# EAGLE design YOTSUBA_MC_ver.2.4.1 (EAGLE 9.6.2)
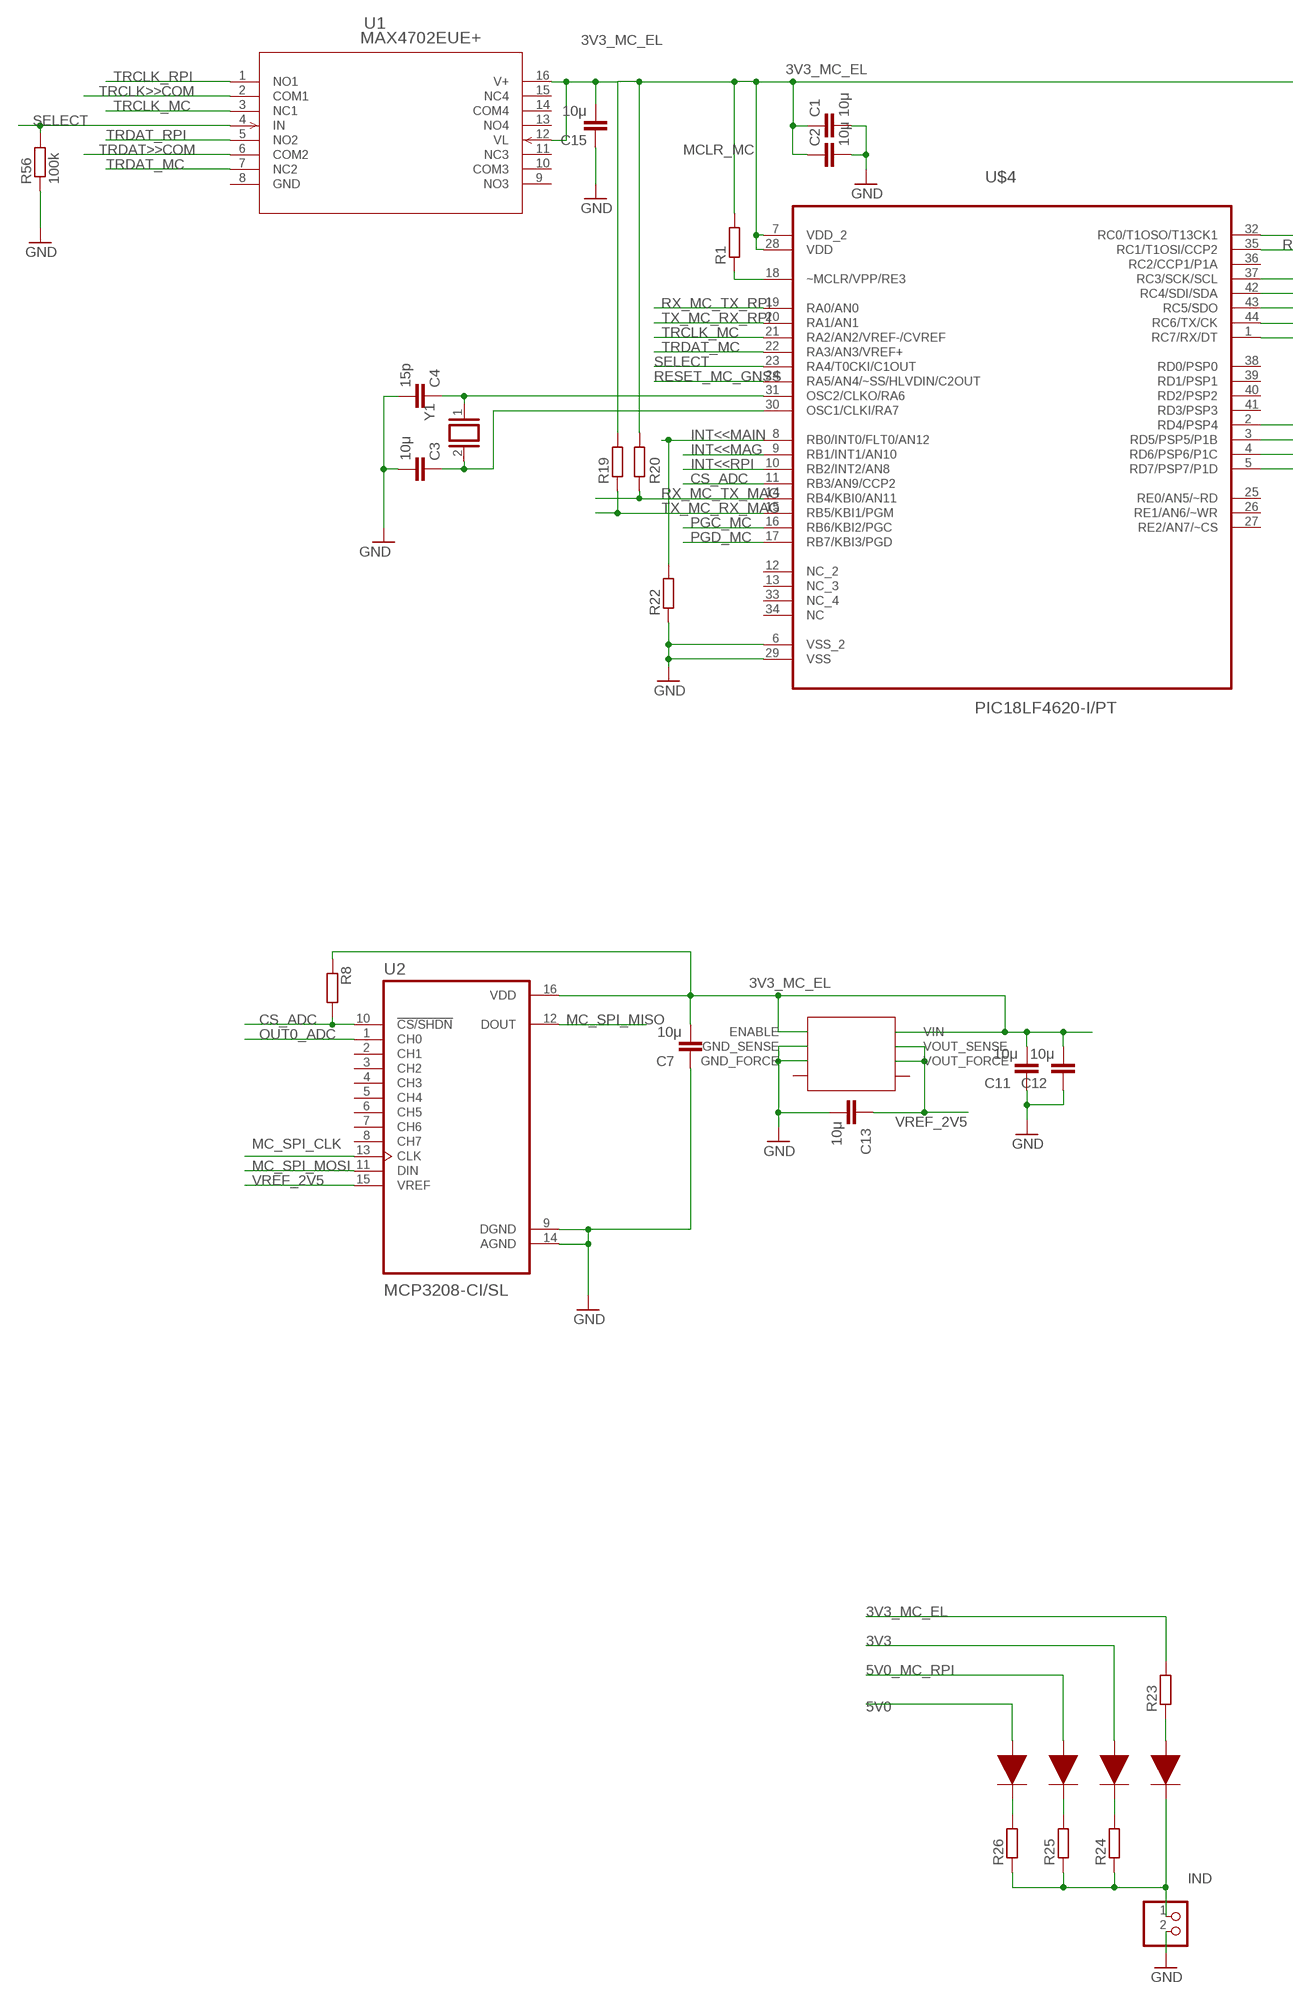
[diagram p0: schematic, sheet 1, part 1 of 2]
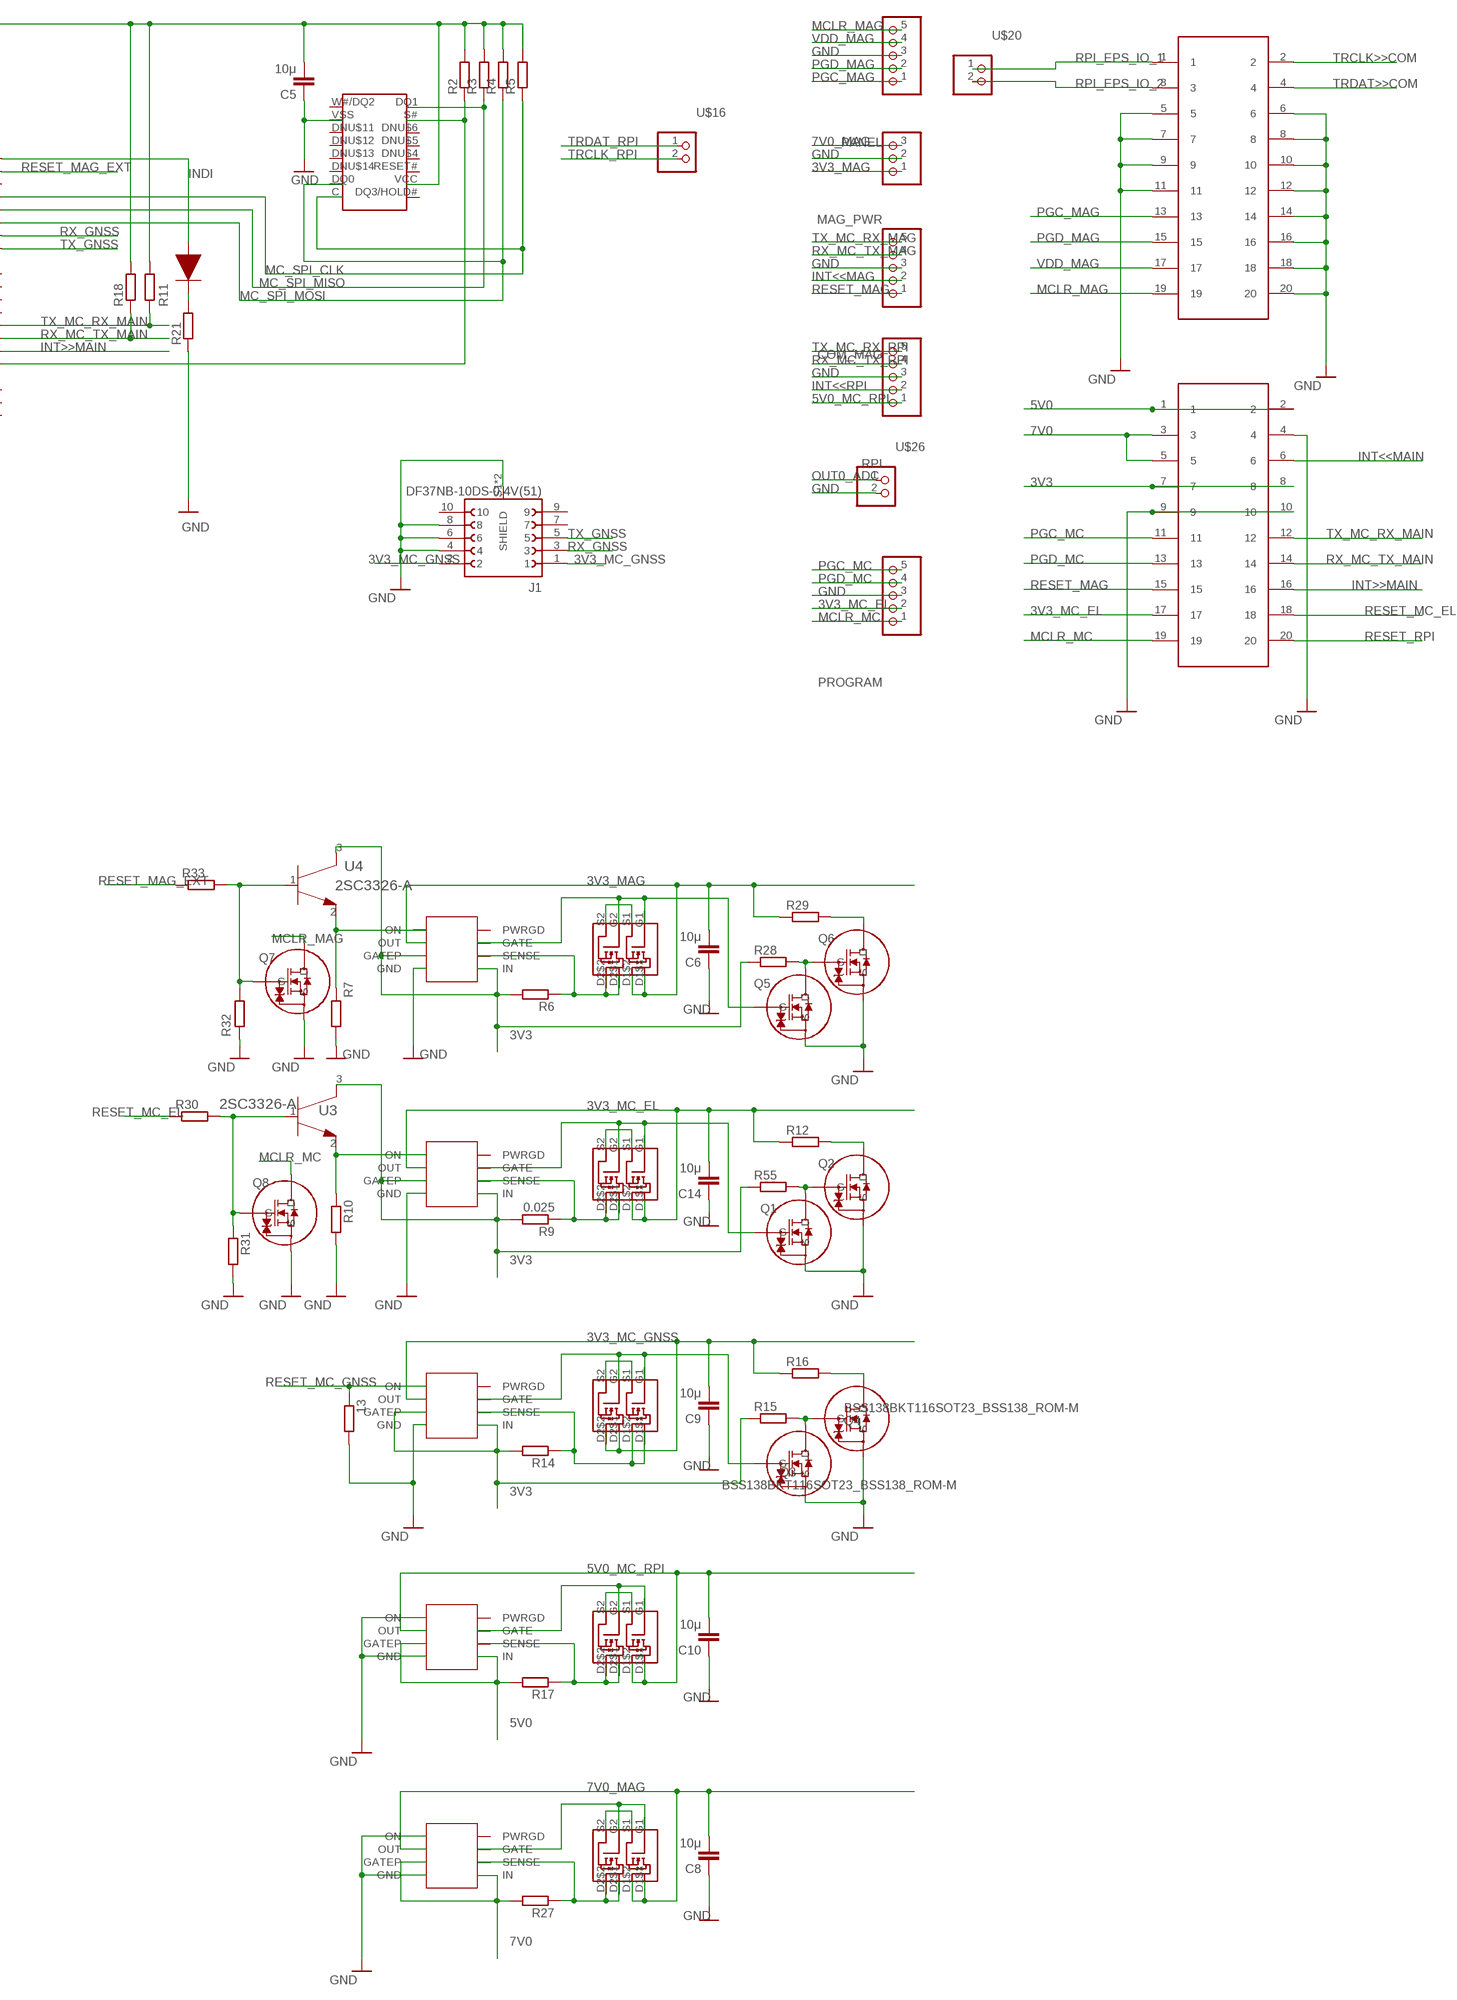
[diagram p1: schematic, sheet 1, part 2 of 2]

## Parts
13  R-EU_R2012  [R2012]
C1  10μ  C-EUC2012  [C2012]
C2  10μ  C-EUC2012  [C2012]
C3  10μ  C-EUC2012  [C2012]
C4  15p  C-EUC2012  [C2012]
C5  10μ  C-EUC2012  [C2012]
C6  10μ  C-EUC2012  [C2012]
C7  10μ  C-EUC2012  [C2012]
C8  10μ  C-EUC2012  [C2012]
C9  10μ  C-EUC2012  [C2012]
C10  10μ  C-EUC2012  [C2012]
C11  10μ  C-EUC2012  [C2012]
C12  10μ  C-EUC2012  [C2012]
C13  10μ  C-EUC2012  [C2012]
C14  10μ  C-EUC2012  [C2012]
C15  10μ  C-EUC2012  [C2012]
COM_MAG  PINHD-1X5  [1X05]
IND  PINHD-1X2  [1X02]
J1  DF37NB-10DS-0.4V(51)  [HRS_DF37NB-10DS-0.4V(51)]
MAG_PWR  PINHD-1X3  [1X03]
PANEL  PINHD-1X5  [1X05]
PROGRAM  PINHD-1X5  [1X05]
Q1  BSS138BKT116SOT23_BSS138_ROM-M  [SOT23_BSS138_ROM-M]
Q2  BSS138BKT116SOT23_BSS138_ROM-M  [SOT23_BSS138_ROM-M]
Q3  BSS138BKT116SOT23_BSS138_ROM-M  [SOT23_BSS138_ROM-M]
Q4  BSS138BKT116SOT23_BSS138_ROM-M  [SOT23_BSS138_ROM-M]
Q5  BSS138BKT116SOT23_BSS138_ROM-M  [SOT23_BSS138_ROM-M]
Q6  BSS138BKT116SOT23_BSS138_ROM-M  [SOT23_BSS138_ROM-M]
Q7  BSS138BKT116SOT23_BSS138_ROM-M  [SOT23_BSS138_ROM-M]
Q8  BSS138BKT116SOT23_BSS138_ROM-M  [SOT23_BSS138_ROM-M]
R1  R-EU_R2012  [R2012]
R2  R-EU_R2012  [R2012]
R3  R-EU_R2012  [R2012]
R4  R-EU_R2012  [R2012]
R5  R-EU_R2012  [R2012]
R6  R-EU_R2012  [R2012]
R7  R-EU_R2012  [R2012]
R8  R-EU_R2012  [R2012]
R9  0.025  R-EU_R2012  [R2012]
R10  R-EU_R2012  [R2012]
R11  R-EU_R2012  [R2012]
R12  R-EU_R2012  [R2012]
R14  R-EU_R2012  [R2012]
R15  R-EU_R2012  [R2012]
R16  R-EU_R2012  [R2012]
R17  R-EU_R2012  [R2012]
R18  R-EU_R2012  [R2012]
R19  R-EU_R2012  [R2012]
R20  R-EU_R2012  [R2012]
R21  R-EU_R2012  [R2012]
R22  R-EU_R2012  [R2012]
R23  R-EU_R2012  [R2012]
R24  R-EU_R2012  [R2012]
R25  R-EU_R2012  [R2012]
R26  R-EU_R2012  [R2012]
R27  R-EU_R2012  [R2012]
R28  R-EU_R2012  [R2012]
R29  R-EU_R2012  [R2012]
R30  R-EU_R2012  [R2012]
R31  R-EU_R2012  [R2012]
R32  R-EU_R2012  [R2012]
R33  R-EU_R2012  [R2012]
R55  R-EU_R2012  [R2012]
R56  100k  R-EU_R2012  [R2012]
RPI  PINHD-1X5  [1X05]
U1  MAX4702EUE+  [21-0066J_16]
U2  MCP3208-CI/SL  [SOIC127P600X175-16N]
U3  2SC3326-A  [S-MINI_TOS]
U4  2SC3326-A  [S-MINI_TOS]
U$1  MT25QL512_16SOP2  [SOIC127P1032X265-16N]
U$2  DMG6898LSD  [SOIC127P600X150-8N]
U$3  LTC4361  [SOP65P280X100-8N]
U$4  PIC18LF4620-I/PT  [QFP80P1200X1200X120-44N]
U$7  DMG6898LSD  [SOIC127P600X150-8N]
U$8  LTC4361  [SOP65P280X100-8N]
U$9  DMG6898LSD  [SOIC127P600X150-8N]
U$10  DMG6898LSD  [SOIC127P600X150-8N]
U$11  LTC4361  [SOP65P280X100-8N]
U$12  LTC4361  [SOP65P280X100-8N]
U$13  DMG6898LSD  [SOIC127P600X150-8N]
U$14  LTC4361  [SOP65P280X100-8N]
U$16  PINHD-1X2  [1X02]
U$17  M50-3001045  [M50-3001045]
U$18  LED_1608  [LED_1608]
U$19  ADR35XX  [SOP65P490X110-8N]
U$20  PINHD-1X2  [1X02]
U$21  LED_1608  [LED_1608]
U$22  M50-3001045  [M50-3001045]
U$23  LED_1608  [LED_1608]
U$24  LED_1608  [LED_1608]
U$25  LED_1608  [LED_1608]
U$26  PINHD-1X2  [1X02]
Y1  HC-49/U-S16000000ABJB  [XTAL_HC49P488W43L1150T466H350]

## Nets
3V3 [POWER]: R6.2 R9.2 R14.2 R15.1 R28.1 R55.1 U3.3(COLLECTOR) U4.3(COLLECTOR) U$3.GATEP U$3.IN U$8.GATEP U$8.IN U$11.GATEP U$11.IN U$17.7 U$17.8 U$23.A
3V3_MAG [POWER]: C6.2 MAG_PWR.1 R29.1 U$2.D1$1 U$2.D1$2 U$3.OUT
3V3_MC_EL [POWER]: C1.1 C2.1 C5.2 C7.2 C11.2 C12.2 C14.2 C15.2 PROGRAM.2 R1.2 R2.2 R3.2 R4.2 R5.2 R8.1 R11.2 R12.1 R18.2 R19.2 R20.2 R23.2 U1.12(VL) U1.16(V+) U2.16(VDD) U$1.VCC U$4.7(VDD_2) U$4.28(VDD) U$7.D1$1 U$7.D1$2 U$8.OUT U$17.17 U$19.ENABLE U$19.VIN
3V3_MC_GNSS [POWER]: C9.2 J1.1 J1.2 R16.1 U$10.D2$1 U$10.D2$2 U$11.OUT
5V0 [POWER]: R17.2 U$14.GATEP U$14.IN U$17.1 U$17.2 U$25.A
5V0_MC_RPI [POWER]: C10.2 RPI.1 U$13.D1$1 U$13.D1$2 U$14.OUT U$24.A
7V0 [POWER]: R27.2 U$12.GATEP U$12.IN U$17.3 U$17.5
7V0_MAG [POWER]: C8.2 MAG_PWR.3 U$9.D1$1 U$9.D1$2 U$12.OUT
CS_ADC: R8.2 U2.10(!CS/SHDN) U$4.11(RB3/AN9/CCP2)
GND [gnd]: 13.2 C1.2 C2.2 C3.2 C4.2 C5.1 C6.1 C7.1 C8.1 C9.1 C10.1 C11.1 C12.1 C13.2 C14.1 C15.1 COM_MAG.3 IND.2 J1.4 J1.6 J1.8 J1.S1(SHIELD) J1.S2(SHIELD) MAG_PWR.2 PANEL.3 PROGRAM.3 Q1.1(S) Q2.1(S) Q3.1(S) Q4.1(S) Q5.1(S) Q6.1(S) Q7.1(S) Q8.1(S) R7.2 R10.2 R21.1 R22.1 R31.2 R32.2 R56.1 RPI.3 U2.9(DGND) U2.14(AGND) U$1.VSS U$3.GND U$4.6(VSS_2) U$4.29(VSS) U$8.GND U$11.GND U$12.GND U$12.ON U$14.GND U$14.ON U$17.4 U$17.9 U$17.10 U$19.GND_FORCE U$19.GND_SENSE U$22.5 U$22.6 U$22.7 U$22.8 U$22.9 U$22.10 U$22.11 U$22.12 U$22.14 U$22.16 U$22.18 U$22.20 U$26.2
INDI: U$4.32(RC0/T1OSO/T13CK1) U$18.A
INT<<MAG: COM_MAG.2 U$4.9(RB1/INT1/AN10)
INT<<MAIN: R22.2 U$4.8(RB0/INT0/FLT0/AN12) U$17.6
INT<<RPI: RPI.2 U$4.10(RB2/INT2/AN8)
INT>>MAIN: U$4.4(RD6/PSP6/P1C) U$17.16
MC_SPI_CLK: R5.1 U2.13(CLK) U$1.C U$4.37(RC3/SCK/SCL)
MC_SPI_MISO: R3.1 U2.12(DOUT) U$1.DQ1 U$4.42(RC4/SDI/SDA)
MC_SPI_MOSI: R4.1 U2.11(DIN) U$1.DQ0 U$4.43(RC5/SDO)
MCLR_MAG: PANEL.5 Q7.3(D) U$22.19
MCLR_MC: PROGRAM.1 Q8.3(D) R1.1 U$4.18(~MCLR/VPP/RE3) U$17.19
N$1: R10.1 U3.2(EMITTER) U$8.ON
N$2: R23.1 U$21.A
N$3: C3.1 U$4.30(OSC1/CLKI/RA7) Y1.2
N$4: R24.2 U$23.C
N$5: C4.1 U$4.31(OSC2/CLKO/RA6) Y1.1
N$6: R25.2 U$24.C
N$7: R26.2 U$25.C
N$8: R2.1 U$1.S# U$4.5(RD7/PSP7/P1D)
N$9: IND.1 R24.1 R25.1 R26.1 U$21.C
N$10: U$2.S1 U$2.S2
N$11: R6.1 U$2.D2$1 U$2.D2$2 U$3.SENSE
N$12: Q5.2(G) U$2.G1 U$2.G2 U$3.GATE
N$13: Q5.3(D) Q6.2(G) R28.2
N$14: U$9.S1 U$9.S2
N$15: R21.2 U$18.C
N$16: R27.1 U$9.D2$1 U$9.D2$2 U$12.SENSE
N$17: U$9.G1 U$9.G2 U$12.GATE
N$18: Q6.3(D) R29.2
N$19: U$7.S1 U$7.S2
N$20: R9.1 U$7.D2$1 U$7.D2$2 U$8.SENSE
N$21: Q8.2(G) R30.2 R31.1 U3.1(BASE)
N$22: Q1.2(G) U$7.G1 U$7.G2 U$8.GATE
N$23: R7.1 U4.2(EMITTER) U$3.ON
N$24: Q1.3(D) Q2.2(G) R55.2
N$25: Q7.2(G) R32.1 R33.2 U4.1(BASE)
N$26: Q2.3(D) R12.2
N$28: U$10.S1 U$10.S2
N$29: R14.1 U$10.D1$1 U$10.D1$2 U$11.SENSE
N$30: Q3.2(G) U$10.G1 U$10.G2 U$11.GATE
N$33: Q3.3(D) Q4.2(G) R15.2
N$34: Q4.3(D) R16.2
N$36: U$13.S1 U$13.S2
N$37: R17.1 U$13.D2$1 U$13.D2$2 U$14.SENSE
N$38: U$13.G1 U$13.G2 U$14.GATE
OUT0_ADC: U2.1(CH0) U$26.1
PGC_MAG: PANEL.1 U$22.13
PGC_MC: PROGRAM.5 U$4.16(RB6/KBI2/PGC) U$17.11
PGD_MAG: PANEL.2 U$22.15
PGD_MC: PROGRAM.4 U$4.17(RB7/KBI3/PGD) U$17.13
RESET_MAG: COM_MAG.1 U$17.15
RESET_MAG_EXT: R33.1 U$4.35(RC1/T1OSI/CCP2)
RESET_MC_EL: R30.1 U$17.18
RESET_MC_GNSS: 13.1 U$4.24(RA5/AN4/~SS/HLVDIN/C2OUT) U$11.ON
RESET_RPI: U$17.20
RPI_EPS_IO_1: U$20.1 U$22.1
RPI_EPS_IO_2: U$20.2 U$22.3
RX_GNSS: J1.3 U$4.44(RC6/TX/CK)
RX_MC_TX_MAG: COM_MAG.4 R20.1 U$4.14(RB4/KBI0/AN11)
RX_MC_TX_MAIN: R18.1 U$4.3(RD5/PSP5/P1B) U$17.14
RX_MC_TX_RPI: RPI.4 U$4.19(RA0/AN0)
SELECT: R56.2 U1.4(IN) U$4.23(RA4/T0CKI/C1OUT)
TRCLK>>COM: U1.2(COM1) U$22.2
TRCLK_MC: U1.3(NC1) U$4.21(RA2/AN2/VREF-/CVREF)
TRCLK_RPI: U1.1(NO1) U$16.1
TRDAT>>COM: U1.6(COM2) U$22.4
TRDAT_MC: U1.7(NC2) U$4.22(RA3/AN3/VREF+)
TRDAT_RPI: U1.5(NO2) U$16.2
TX_GNSS: J1.5 U$4.1(RC7/RX/DT)
TX_MC_RX_MAG: COM_MAG.5 R19.1 U$4.15(RB5/KBI1/PGM)
TX_MC_RX_MAIN: R11.1 U$4.2(RD4/PSP4) U$17.12
TX_MC_RX_RPI: RPI.5 U$4.20(RA1/AN1)
VDD_MAG: PANEL.4 U$22.17
VREF_2V5: C13.1 U2.15(VREF) U$19.VOUT_FORCE U$19.VOUT_SENSE
Unconnected: J1.7 J1.9 J1.10 U1.9(NO3) U1.10(COM3) U1.11(NC3) U1.13(NO4) U1.14(COM4) U1.15(NC4) U2.2(CH1) U2.3(CH2) U2.4(CH3) U2.5(CH4) U2.6(CH5) U2.7(CH6) U2.8(CH7) U$1.DNU$4 U$1.DNU$5 U$1.DNU$6 U$1.DNU$11 U$1.DNU$12 U$1.DNU$13 U$1.DNU$14 U$1.DQ3/HOLD# U$1.RESET# U$1.W#/DQ2 U$3.PWRGD U$4.12(NC_2) U$4.13(NC_3) U$4.25(RE0/AN5/~RD) U$4.26(RE1/AN6/~WR) U$4.27(RE2/AN7/~CS) U$4.33(NC_4) U$4.34(NC) U$4.36(RC2/CCP1/P1A) U$4.38(RD0/PSP0) U$4.39(RD1/PSP1) U$4.40(RD2/PSP2) U$4.41(RD3/PSP3) U$8.PWRGD U$11.PWRGD U$12.PWRGD U$14.PWRGD U$19.NIC@1(NIC) U$19.NIC@2(NIC)

## Power pins joined to a net without a drawn wire
GND: U1.8(GND)

## Library data of the parts
13 R1-R12 R14-R33 R55 R56 = rcl:R-EU_: RESISTOR, European symbol; SPICEPREFIX: R
C1-C15 = rcl:C-EU: CAPACITOR, European symbol; SPICEPREFIX: C
COM_MAG PANEL PROGRAM RPI = pinhead:PINHD-1X5: PIN HEADER
IND U$16 U$20 U$26 = pinhead:PINHD-1X2: PIN HEADER
J1 = DF37NB-10DS-0.4V_51_:DF37NB-10DS-0.4V(51): Check availability <https://pricing.snapeda.com/parts/DF37NB-10DS-0.4V%2851%29/Hirose/view-part?ref=eda>; AVAILABILITY: In Stock; DESCRIPTION: 10 Position Connector Receptacle, Center Strip Contacts Surface Mount Gold; MF: Hirose; MP: DF37NB-10DS-0.4V(51); PACKAGE: None; PRICE: None; PURCHASE-URL: https://pricing.snapeda.com/search?q=DF37NB-10DS-0.4V(51)&ref=eda
MAG_PWR = pinhead:PINHD-1X3: PIN HEADER
Q1-Q8 = BSS138BKT:BSS138BKT116; COPYRIGHT: Copyright (C) 2023 Ultra Librarian. All rights reserved.; DIGIKEY_PART_NUMBER_1: 846-BSS138BKT116TR-ND; DIGIKEY_PART_NUMBER_2: 846-BSS138BKT116CT-ND; DIGIKEY_PART_NUMBER_3: 846-BSS138BKT116DKR-ND; MANUFACTURER_PART_NUMBER: BSS138BKT116; MFR_NAME: ROHM Semiconductor
U1 = MAX4702:MAX4702EUE+; COPYRIGHT: Copyright (C) 2022 Ultra Librarian. All rights reserved.; MANUFACTURER_PART_NUMBER: MAX4702EUE+; MFR_NAME: Analog Devices Inc
U2 = MCP3208-CI_SL:MCP3208-CI/SL: Check availability <https://pricing.snapeda.com/parts/MCP3208-CI/SL/Microchip%20Technology/view-part?ref=eda>; AVAILABILITY: In Stock; DESCRIPTION: 12 Bit Analog to Digital Converter 4, 8 Input 1 SAR 16-SOIC; MF: Microchip Technology; MP: MCP3208-CI/SL; PACKAGE: SOIC-16 Microchip; PRICE: None; PURCHASE-URL: https://pricing.snapeda.com/search?q=MCP3208-CI/SL&ref=eda
U3 U4 = 2sc3326:2SC3326-A; COPYRIGHT: Copyright (C) 2023 Ultra Librarian. All rights reserved.; DIGIKEY_PART_NUMBER_1: 2SC3326-ALFTR-ND; DIGIKEY_PART_NUMBER_2: 2SC3326-ALFCT-ND; DIGIKEY_PART_NUMBER_3: 2SC3326-ALFDKR-ND; MANUFACTURER_PART_NUMBER: 2SC3326-A; MFR_NAME: Toshiba Electronic Devices & Storage Corp.
U$1 = MT25QL512_8:MT25QL512_16SOP2
U$2 U$7 U$9 U$10 U$13 = DMG6898LSD:DMG6898LSD
U$3 U$8 U$11 U$12 U$14 = ltc4361:LTC4361
U$4 = PIC18LF4620-I_PT:PIC18LF4620-I/PT: Flash Microcontrollers Check availability <https://pricing.snapeda.com/parts/PIC18LF4620-I/PT/Microchip/view-part?ref=eda>; AVAILABILITY: In Stock; DESCRIPTION: PIC PIC® 18F Microcontroller IC 8-Bit 40MHz 64KB (32K x 16) FLASH 44-TQFP (10x10); MF: Microchip; MP: PIC18LF4620-I/PT; PACKAGE: TQFP-44 Microchip; PRICE: None; PURCHASE-URL: https://pricing.snapeda.com/search?q=PIC18LF4620-I/PT&ref=eda
U$17 U$22 = MITSUBA_Connectors-v4.0:M50-3001045: 20pins 1.27mm pitch 2line pinsocket
U$18 U$21 U$23-U$25 = LED_1608:LED_1608
U$19 = adr35xx:ADR35XX
Y1 = HC-49_U-S16000000ABJB:HC-49/U-S16000000ABJB: HC49US Series 16 MHz ±30 ppm 18 pF -20 to +70 °C Through Hole AT-CUT Crystal; DESCRIPTION: 16 MHz ±30ppm Crystal 18pF 50 Ohms HC-49/US; DIGI-KEY_PART_NUMBER: 300-6034-ND; MF: Citizen Finedevice Co Ltd; MP: HC-49/U-S16000000ABJB; PACKAGE: HC-49/US Citizen Finetech Miyota; PURCHASE-URL: https://pricing.snapeda.com/search?q=HC-49/U-S16000000ABJB&ref=eda

## Net classes
0 default: clearance 0.178 mm
1 ant: clearance 0.559 mm
2 gnd: clearance 0.381 mm
3 POWER: width 0.178 mm, clearance 0.254 mm

## Board
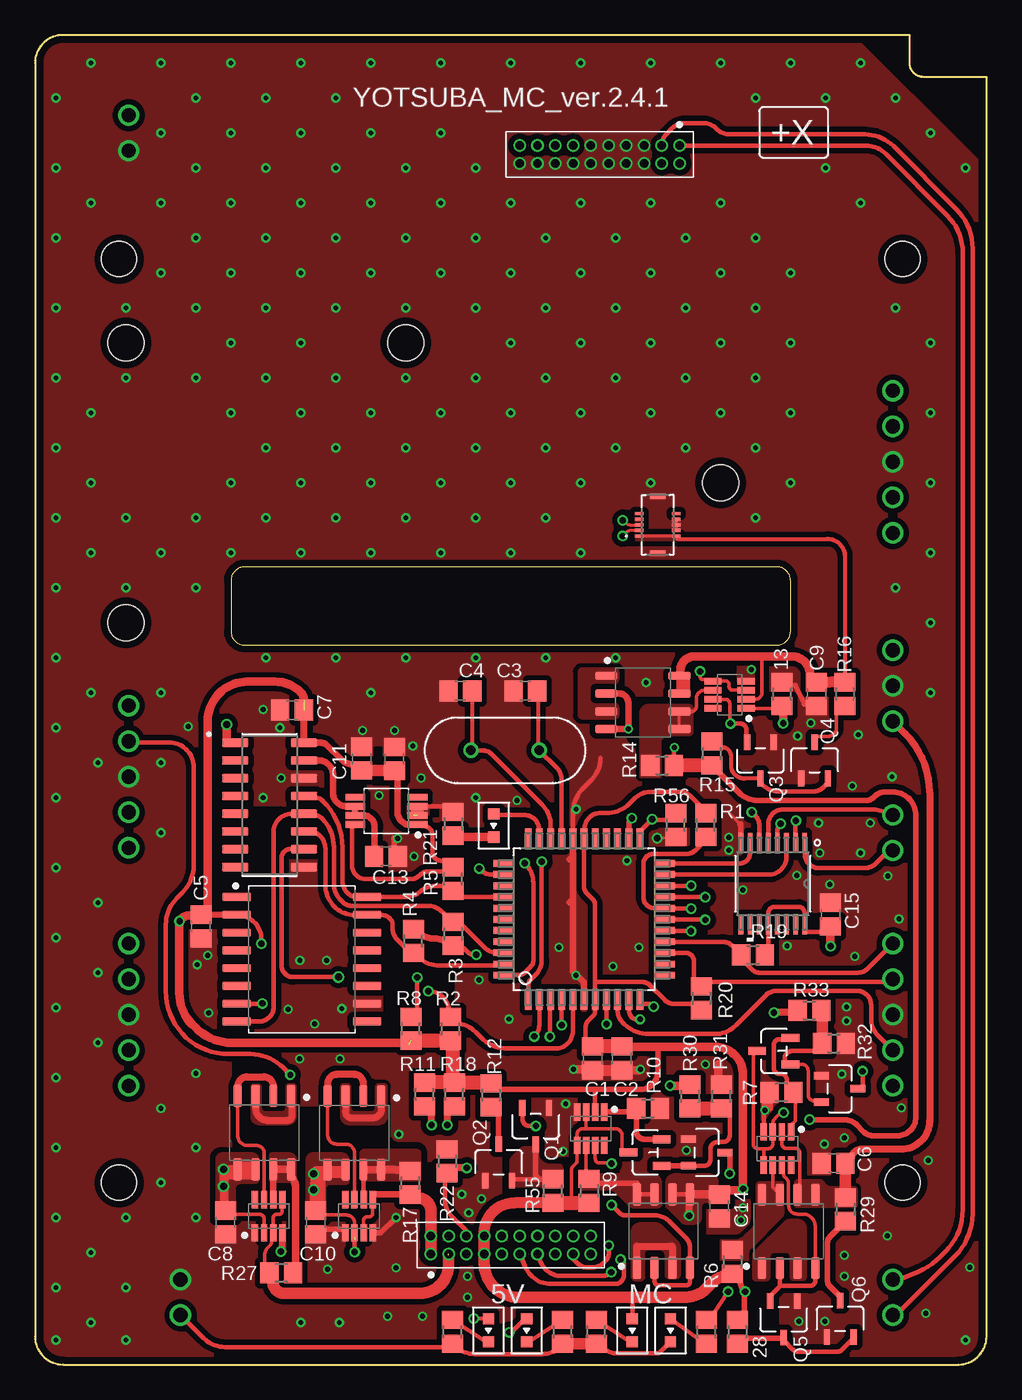
[diagram p2: board, top side]
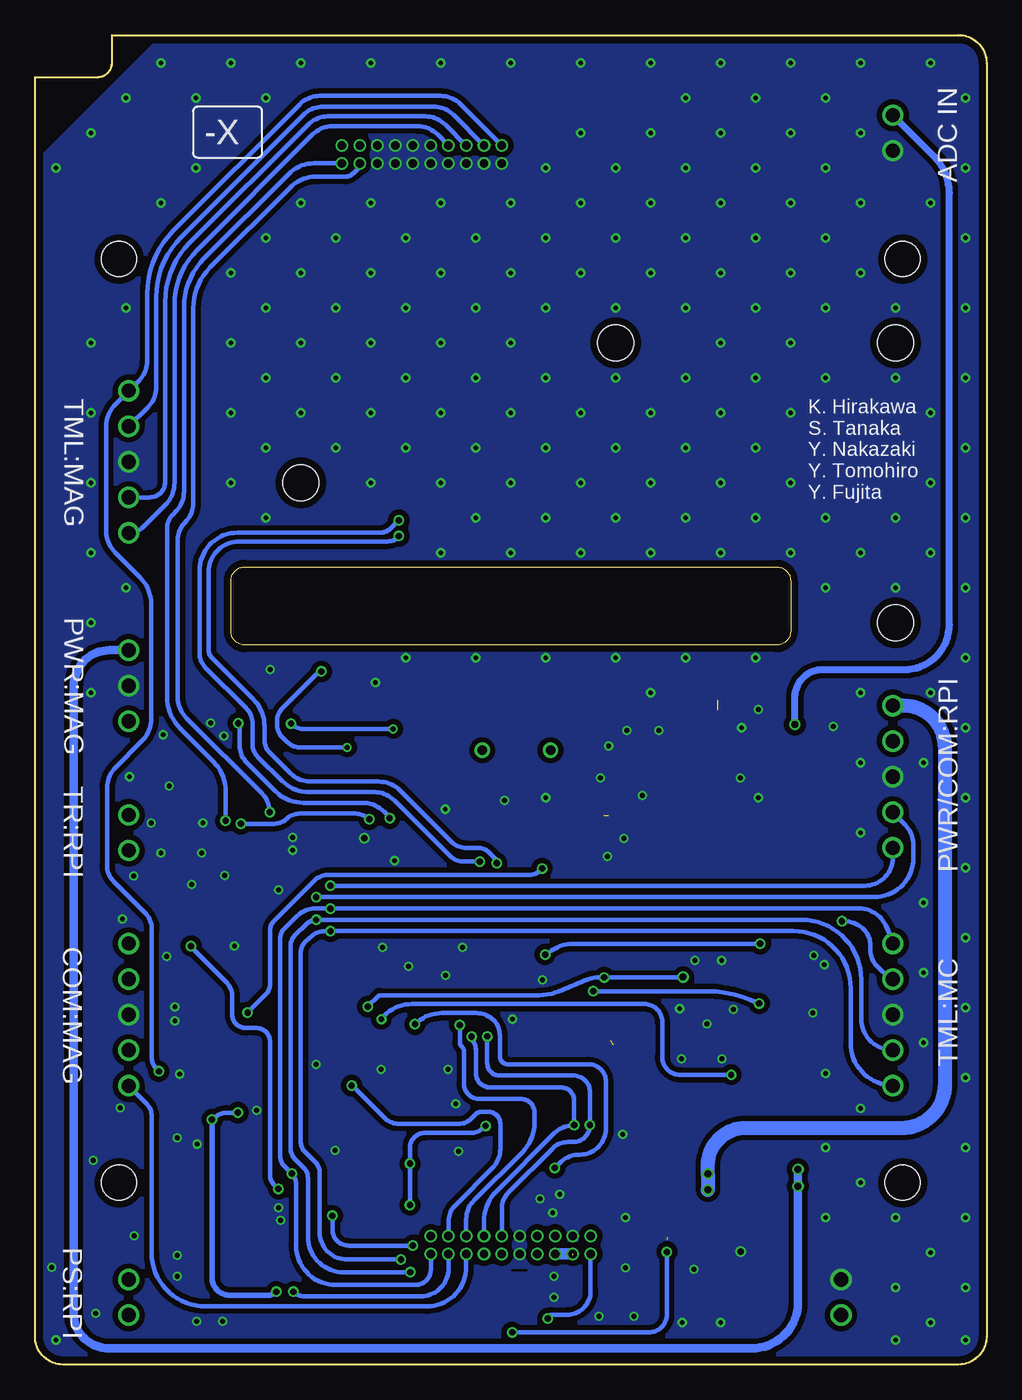
[diagram p3: board, bottom side, seen from below]

Size 68 x 95 mm. Coordinates in mm from the lower left corner, seen from the top.
Outline: 0,93 0,2 arc90 2,0 66,0 arc90 68,2 68,92 63.5,92 arc-90 62.5,93 62.5,95 2,95 arc90 0,93
Outline: 14,56 14,52.4 arc90 15,51.4 53,51.4 arc90 54,52.4 54,56 arc90 53,57 15,57 arc90 14,56
Copper layers (1*16): Top 0.035mm / dielectric 1.53mm / Bottom 0.035mm
Design rules "pban_5mil-l2": minimum track width 5mil, minimum drill 0.3mm, track to track 5mil, track to pad 0.229mm, pad to pad 5mil, via to via 5mil, smd to smd 5mil, copper to edge 0.5mm, drill to drill 0.5mm, minimum pad ring 0.15mm, minimum via ring 0.15mm, stop-mask expansion 4mil, vias tented up to drill 0.35mm, thermal gap 10mil
Holes 2.5 mm at 6,13 62,13 62,79 6,79
Holes 2.6 mm at 6.5,73 6.5,53 49,63 26.5,73
tRestrict: area 24.3,43.8 to 24.7,44.1; area 15,33.9 to 16.7,34.2; area 28.2,39.1 to 28.9,39.7; 48 lines
bRestrict: area 32.9,6.8 to 33.9,6.8; area 6.4,24.7 to 6.9,25

### Footprints (pad centres in the part's own frame; a part is rotated, then mirrored left to right if it is on the bottom)
R2012 = smd 1.3 x 1.5: 1 -0.85,0; 2 0.85,0
C2012 = smd 1.3 x 1.5: 1 -0.85,0; 2 0.85,0
1X05 = drill 1.016: 1 -5.08,0; 2 -2.54,0; 3 0,0; 4 2.54,0; 5 5.08,0
1X02 = drill 1.016: 1 -1.27,0; 2 1.27,0
HRS_DF37NB-10DS-0.4V(51) = smd 0.23 x 0.63: 1 0.8,-1.325; 2 0.8,1.325; 3 0.4,-1.325; 4 0.4,1.325; 5 0,-1.325; 6 0,1.325; 7 -0.4,-1.325; 8 -0.4,1.325; 9 -0.8,-1.325; 10 -0.8,1.325 | smd 0.38 x 1.1: S1 2.04,0; S2 -2.04,0
1X03 = drill 1.016: 1 -2.54,0; 2 0,0; 3 2.54,0
SOT23_BSS138_ROM-M = smd 1.105 x 0.508: 1 -1.302,0.95; 2 -1.302,-0.95; 3 1.302,0
21-0066J_16 = smd 1.379 x 0.34: 1 -2.937,2.275; 2 -2.937,1.625; 3 -2.937,0.975; 5 -2.937,-0.325; 6 -2.937,-0.975; 7 -2.937,-1.625; 8 -2.937,-2.275; 9 2.937,-2.275; 10 2.937,-1.625; 11 2.937,-0.975; 12 2.937,-0.325; 13 2.937,0.325; 14 2.937,0.975; 15 2.937,1.625; 16 2.937,2.275 | smd 1.379 x 0.3: 4 -2.937,0.325
SOIC127P600X175-16N = smd 1.9 x 0.6: 1 -2.455,4.445; 2 -2.455,3.175; 3 -2.455,1.905; 4 -2.455,0.635; 5 -2.455,-0.635; 6 -2.455,-1.905; 7 -2.455,-3.175; 8 -2.455,-4.445; 9 2.455,-4.445; 10 2.455,-3.175; 11 2.455,-1.905; 12 2.455,-0.635; 13 2.455,0.635; 14 2.455,1.905; 15 2.455,3.175; 16 2.455,4.445
S-MINI_TOS = smd 0.56 x 1.325: 1 -0.95,-1.187; 2 0.95,-1.187; 3 0,1.187
SOIC127P1032X265-16N = smd 2.052 x 0.602: C 4.654,4.445; DNU$4 -4.654,0.635; DNU$5 -4.654,-0.635; DNU$6 -4.654,-1.905; DNU$11 4.654,-1.905; DNU$12 4.654,-0.635; DNU$13 4.654,0.635; DNU$14 4.654,1.905; DQ0 4.654,3.175; DQ1 -4.654,-4.445; DQ3/HOLD# -4.654,4.445; RESET# -4.654,1.905; S# -4.654,-3.175; VCC -4.654,3.175; VSS 4.654,-3.175; W#/DQ2 4.654,-4.445
SOIC127P600X150-8N = smd 1.58 x 0.589: D1$1 -2.625,1.905; D1$2 -2.625,0.635; D2$1 -2.625,-0.635; D2$2 -2.625,-1.905; G1 2.625,1.905; G2 2.625,-0.635; S1 2.625,0.635; S2 2.625,-1.905
SOP65P280X100-8N = smd 1.237 x 0.459: GATE 1.187,0.325; GATEP -1.187,-0.325; GND -1.187,-0.975; IN 1.187,-0.975; ON -1.187,0.975; OUT -1.187,0.325; PWRGD 1.187,0.975; SENSE 1.187,-0.325
QFP80P1200X1200X120-44N = smd 1.473 x 0.483: 1 -5.74,3.988; 2 -5.74,3.2; 3 -5.74,2.388; 4 -5.74,1.6; 5 -5.74,0.787; 6 -5.74,0; 7 -5.74,-0.787; 8 -5.74,-1.6; 9 -5.74,-2.388; 10 -5.74,-3.2; 11 -5.74,-3.988; 23 5.74,-3.988; 24 5.74,-3.2; 25 5.74,-2.388; 26 5.74,-1.6; 27 5.74,-0.787; 28 5.74,0; 29 5.74,0.787; 30 5.74,1.6; 31 5.74,2.388; 32 5.74,3.2; 33 5.74,3.988 | smd 0.483 x 1.473: 12 -3.988,-5.74; 13 -3.2,-5.74; 14 -2.388,-5.74; 15 -1.6,-5.74; 16 -0.787,-5.74; 17 0,-5.74; 18 0.787,-5.74; 19 1.6,-5.74; 20 2.388,-5.74; 21 3.2,-5.74; 22 3.988,-5.74; 34 3.988,5.74; 35 3.2,5.74; 36 2.388,5.74; 37 1.6,5.74; 38 0.787,5.74; 39 0,5.74; 40 -0.787,5.74; 41 -1.6,5.74; 42 -2.388,5.74; 43 -3.2,5.74; 44 -3.988,5.74
M50-3001045 = drill 0.6: 1 0,0; 2 0,1.27; 3 1.27,0; 4 1.27,1.27; 5 2.54,0; 6 2.54,1.27; 7 3.81,0; 8 3.81,1.27; 9 5.08,0; 10 5.08,1.27; 11 6.35,0; 12 6.35,1.27; 13 7.62,0; 14 7.62,1.27; 15 8.89,0; 16 8.89,1.27; 17 10.16,0; 18 10.16,1.27; 19 11.43,0; 20 11.43,1.27
LED_1608 = smd 0.8 x 0.8: A 0.4,0.4; C 2.05,0.4
SOP65P490X110-8N = smd 1.424 x 0.497: ENABLE -2.219,0.975; GND_FORCE -2.219,-0.325; GND_SENSE -2.219,0.325; NIC@1 -2.219,-0.975; NIC@2 2.219,-0.975; VIN 2.219,0.975; VOUT_FORCE 2.219,-0.325; VOUT_SENSE 2.219,0.325
XTAL_HC49P488W43L1150T466H350 = drill 0.68 pad 1.08: 1 -2.44,0; 2 2.44,0

### Placement (x,y rotation side)
13  53.39,47.9 90 top
C1  39.85,21.88 270 top
C2  41.94,21.88 270 top
C3  35.05,48.14 180 top
C4  30.39,48.14 180 top
C5  11.87,31.29 90 top
C6  57.06,14.39 0 top
C7  18.37,46.76 0 top
C8  13.61,10.15 90 top
C9  55.85,47.9 90 top
C10  20.07,10.15 90 top
C11  23.35,43.29 270 top
C12  25.69,43.28 270 top
C13  25.08,36.32 0 top
C14  48.9,11.3 90 top
C15  56.85,32.15 270 top
COM_MAG  61.3,25 90 top
IND  10.4,4.8 90 top
J1  44.5,60 270 top
MAG_PWR  61.3,48.5 90 top
PANEL  61.3,64.5 90 top
PROGRAM  6.7,25 270 top
Q1  35.78,17.04 270 top
Q2  33.14,14.45 90 top
Q3  51.84,43.17 270 top
Q4  55.71,43.17 90 top
Q5  53.5,3.23 270 top
Q6  57.54,3.27 90 top
Q7  57.5,19.7 0 top
Q8  48,15.15 0 top
R1  47.93,38.55 90 top
R2  29.68,23.99 270 top
R3  29.87,30.78 270 top
R4  27.04,30.26 90 top
R5  29.88,34.69 90 top
R6  49.84,7.34 270 top
R7  53.34,19.45 180 top
R8  26.86,24 90 top
R9  39.6,12.41 270 top
R10  43.82,18.3 0 top
R11  27.84,19.3 90 top
R12  32.59,19.25 270 top
R14  44.82,42.81 0 top
R15  48.37,43.66 90 top
R16  57.88,47.9 270 top
R17  26.81,12.99 270 top
R18  29.97,19.3 90 top
R19  51.32,29.27 0 top
R20  47.62,26.17 270 top
R21  29.89,38.63 270 top
R22  29.46,14.53 270 top
R23  47.99,2.34 90 top
R24  40.11,2.34 90 top
R25  37.71,2.34 90 top
R26  29.83,2.34 90 top
R27  17.6,6.54 180 top
R28  50.19,2.34 270 top
R29  57.92,11.1 270 top
R30  46.8,19.15 270 top
R31  49.05,19.15 90 top
R32  57.1,22.95 0 top
R33  55.35,25.3 0 top
R55  37.02,12.4 90 top
R56  45.79,38.54 90 top
RPI  6.7,42 270 top
U1  52.73,34.36 270 top
U2  16.77,39.99 0 top
U3  43.6,15.15 90 top
U4  52.8,22.4 90 top
U$1  19.07,28.96 0 top
U$2  53.86,9.52 270 top
U$3  53.05,15.44 270 top
U$4  39.24,31.81 90 top
U$7  44.91,9.54 270 top
U$8  39.71,16.85 270 top
U$9  16.4,16.58 90 top
U$10  43.44,47.31 180 top
U$11  49.63,47.86 180 top
U$12  16.7,10.6 90 top
U$13  22.83,16.55 90 top
U$14  23.16,10.6 90 top
U$16  61.3,38 90 top
U$17  28.29,7.9 0 top
U$18  32.38,39.73 270 top
U$19  25.11,39.56 180 top
U$20  61.3,4.8 270 top
U$21  45.02,3.66 270 top
U$22  46.07,87.1 180 top
U$23  42.28,3.66 270 top
U$24  34.74,3.66 270 top
U$25  32,3.66 270 top
U$26  6.7,88 270 top
Y1  33.59,43.89 0 top

### Tracks (layer width: path | path; a pad name or v marks a point on that pad's centre or on a via)
3V3  (via drill 0.35, 0.45)
  Top 0.25: U$11.GATEP 49.87,48.19 arc-90 49.6,48.45 49.6,48.58 arc90 49.33,48.85 48.43,48.85 | 38.35,11.7 38.35,13.92 arc-45 38.44,14.14 38.64,14.34 arc45 38.73,14.57 U$8.IN 38.73,16.43 arc-90 39.15,16.85 39.38,16.85 | 39.38,16.85 41.48,16.85 arc-90 41.95,16.38 41.95,15.35 42.15,15.15 U3.3 | U$11.IN 48.34,48.94 47.75,48.94 arc-90 47.53,49.15 v47.53,49.52 | U$3.IN 52.08,15.43 52.41,15.43 arc90 52.73,15.74 U$3.GATEP 52.73,17.16 arc-45 52.91,17.61 53.16,17.86 arc-45 v53.5,18 | U$8.GATEP 39.38,16.85
  Top 0.254: U4.3 51.4,22.4 51.33,22.33 51.33,15.74 arc90 51.65,15.43 52.08,15.43
  Top 0.305: U$23.A 42.68,4.8 | U$11.IN 48.43,48.85 48.39,48.85 | 38.35,11.7 38.5,11.55 | R14.2 45.67,44.07 v45.7,44.1
  Top 0.4: R15.1 50.33,40.85 arc45 51.66,40.3 59.37,40.3 arc45 59.93,40.53 60.02,40.62 arc-45 60.7,40.9 61.3,40.9 arc-90 62.95,39.25 62.95,17.67 arc-90 61.63,16.35 59.9,16.35 arc-45 59.21,16.64 58.74,17.11 arc45 57.8,17.5 v55.35,17.5 55.35,17.4 | v50.75,5.2 50.75,5.15
  Top 0.406: R6.2 50.27,6.21 50.62,5.21 v50.75,5.2 50.7,5.1 50.7,3.19 R28.1
  Top 0.8: U$17.8 32.1,9.4 arc-90 34.25,11.55 R55.1 | R9.2
  Top 0.813: U$17.8 U$17.7 32.1,7.25 arc90 34.55,4.8 42.68,4.8 46.4,4.8 arc45 48.02,5.47 48.43,5.88 arc-45 49.55,6.34 49.69,6.34 R6.2
  Top 1: 45.77,42.71 R14.2 R15.1
  Top 1.016: R55.1 38.5,11.55 R9.2
  Bottom 0.305: U$17.8 32.1,9.31 | 47.45,49.5 47.51,49.5 v47.53,49.52 47.68,49.52 50.33,46.87 arc-45 50.7,45.97 50.7,45.73 arc-45 50.33,44.83 49.97,44.47 arc-45 49.07,44.1 v45.7,44.1 | v53.5,18 54.3,18 arc-45 55.16,17.64 55.3,17.5 arc-90 v55.35,17.5
  Bottom 0.4: v55.35,17.5 55.35,6.22 arc-90 54.08,4.95 51.35,4.95 arc-45 v50.75,5.2
3V3_MAG
  Top 0.203: 54.65,12.14 U$2.D1$2
  Top 0.25: U$3.OUT 53.38,15.77 arc90 53.69,15.45 54.33,15.45 arc-90 54.65,15.13 54.65,12.14
  Top 0.5: MAG_PWR.1 62.2,45.06 arc-45 63.93,40.88 63.93,17.41 arc-90 61.9,15.38 59.05,15.38 arc90 58.32,14.64 58.32,14.19 57.92,14.19
  Top 0.813: R29.1 57.92,14.19 C6.2
  pour Top (no thermals): 56.07,13.25 54.57,13.25 arc90 54.25,12.93 54.25,11.42 arc90 54.47,11.2 58.58,11.2 arc90 58.8,11.42 58.8,12.43 arc90 58.48,12.75 56.83,12.75 arc-45 56.61,12.84 56.29,13.16 arc45
3V3_MC_EL  (via drill 0.45)  (2 unrouted)
  Top 0.305: 27.32,31.21 R4.2 27.32,31.49 27.58,31.49 | 29.65,29.91 29.79,29.91 R3.2 29.94,29.76 30.62,29.76 30.91,29.48 arc45 31.36,29.29 v31.54,29.29 | U$17.17 38.45,7.56 38.81,7.2 arc45 39.47,6.93 39.77,6.93 arc45 40.68,7.31 40.81,7.44 arc45 41,7.89 v41,8.5 | 14.31,32.13 U$1.VCC arc-90 16.18,30.37 v16.18,30.07 | 27.6,38.59 U$19.ENABLE 27.43,38.48 27.77,38.48 arc-90 28.4,37.85 28.4,36.63 arc90 29.04,36 29.88,36 R5.2 29.8,35.58 29.47,35.24 28.11,35.24 arc45 27.56,35.01 27.52,34.97 arc-45 26.82,34.68 23.65,34.68 arc-90 22.65,35.68 22.65,38.34 U$19.VIN 23.32,38.59 | 26.45,23.11 26.22,22.88 | R1.2 47.93,39.52 46.84,40.61 arc45 46.11,40.91 43.93,40.91 arc45 42.87,40.47 42.46,40.06 arc-45 40.87,39.4 40.38,39.4 arc45 39.62,39.09 arc45 39.26,38.21 39.26,37.57 U$4.28 39.24,34.13 arc45 39.43,33.68 39.84,33.27 arc-45 40.03,32.82 40.03,27.35 | 49.56,5.23 v49.53,5.2 48.39,3.44 R23.2 | C1.1 39.33,23.25 39.33,24 arc-45 39.59,24.63 39.93,24.98 arc45 40.03,25.2 U$4.7 40.03,27.35 | 40.02,19.65 40.02,18.05 U$8.OUT | U$7.D1$2 U$7.D1$1 | 48.9,12.16 C14.2 | v46.75,10.63 v46.74,10.64 | R19.2 52.41,29.5 U1.12 52.41,32.27 arc-90 52.84,32.7 54.57,32.7 arc-90 55.01,32.27 U1.16 55.01,30.92 56.47,30.92 C15.2 | R20.2 47.17,25.77 45.66,25.77 arc-45 45.01,26.04 43.96,27.09 arc45 43.34,27.35 40.03,27.35
  Top 0.4: R12.1 33.04,19.65 40.02,19.65 43.23,19.65 arc90 44.5,20.92 44.5,22.69 43.85,22.69
  Top 0.45: 45.55,12.49 U$7.D1$2 | U$19.ENABLE 26.9,38.59 arc90 26.86,38.54 arc-90 25.91,39.49 25.91,42.21 arc90 C12.2 arc90 C12.2 | C11.2 22.94,42.85 22.83,42.85 arc-45 21.89,43.24 20.89,44.24 arc45 20.44,44.43 U2.16 | R5.2 arc-45 30,35.64 | 29.79,29.91 arc45 28.49,30.45 28.41,30.45 arc-45 27.37,30.88 R4.2 27.27,31.44 | C5.2 14.29,32.15 14.31,32.13 | C7.2
  Top 0.508: R4.2 27.09,31.16 | U2.16 C7.2 | v46.75,10.63 46.75,12.1 U$7.D1$1
  Top 0.6: R2.2 | 29.83,20.15 R11.2 | U$7.D1$1 48.9,12.16 | C14.2 arc90 49.2,12.45 50.5,12.45 v50.6,12.55 50.6,20.72 arc90 48.63,22.69 43.85,22.69 41.94,22.69 C2.1
  Top 0.61: 11.84,32.11 11.43,32.1 | 11.86,32.15 arc-90 C5.2 | 19.22,47.49 arc45 19,48.03 arc45 17.16,48.79 15.14,48.79 arc45 13.18,47.98 arc45 12.34,45.95 12.34,32.61 C5.2 | 26.58,22.98 14.11,22.98 arc-45 11.46,24.07 11.25,24.29 arc-45 10.31,26.54 10.31,31.66 v10.33,31.68 10.33,31.71 10.42,31.8 arc-45 11.15,32.11 11.84,32.11 | 26.45,23.11 26.58,22.98 | 26.58,22.98 arc-90 26.68,22.88 | 11.84,32.11 C5.2 | v56.85,29.9 C15.2 | R2.2 arc-23 29.69,23.05 29.67,23.05 arc-90 R2.2
  Top 0.8: R2.2 29.83,22.99 | 32.59,20.15 R12.1
  Top 0.813: C11.2 C12.2
  Top 1: R8.1 R2.2 | 29.83,22.99 29.83,20.15
  Top 1.016: R11.2 R18.2 32.59,20.15 | C2.1 C1.1
  Bottom 0.305: v16.18,30.07 16.38,30.07 16.39,30.06 29.57,30.06 arc-45 31.42,29.29 v31.54,29.29 | 10.19,31.68 arc45 8.76,31.09 arc45 8.3,29.97 8.3,29.57 arc-45 7.86,28.51 6.89,27.54 | U$17.17 38.45,6.86 arc90 40.43,4.88 48.79,4.88 arc45 49.5,5.17 v49.53,5.2 | 50.6,12.6 v50.6,12.55 50.98,12.93 arc45 51.2,13.46 51.2,23.05 arc-90 52.2,24.05 52.95,24.05 arc90 53.9,25 53.9,26.24 arc-45 54.36,27.36 56.85,29.85 v56.85,29.9 | v46.75,10.63 46.75,9.65 arc-90 45.6,8.5 v41,8.5
  Bottom 0.406: 6.89,27.54 PROGRAM.2
  Bottom 0.45: v10.33,31.68 10.19,31.68
  pour Top (no thermals): 47.15,10 46.51,10 arc-45 46.15,10.15 45.14,11.16 arc-45 45.05,11.38 45.05,13.02 arc-90 45.69,13.65 48.22,13.65 arc-90 48.85,13.02 48.85,11.55 47.97,11.55 arc90 47.65,11.23 47.65,10.5 arc-90
3V3_MC_GNSS
  Top 0.2: J1.2 45.95,59
  Top 0.225: J1.2 J1.1
  Top 0.254: U$11.OUT 51.48,47.53 arc90 51.95,48 51.95,50.6
  Top 0.3: 45.95,59 56.61,59 arc-90 57.88,57.73 R16.1 | U$10.D2$2 46.56,49.22
  Top 0.5: 46.12,49.27 arc90 U$10.D2$2 U$10.D2$1 | 46.56,49.22 46.56,47.95
  Top 0.6: 46.12,49.27 46.12,49.6 arc-90 47.12,50.6 51.95,50.6 54.06,50.6 arc-90 55.4,49.27 55.4,49.15 55.8,48.75 C9.2
  Top 0.813: C9.2 57.88,48.8 R16.1
  pour Top (no thermals): 46.05,58.85 42.9,58.85 42.9,59.3 46.05,59.3
5V0  (via drill 0.45)
  Top 0.25: U$14.IN 24.14,10.81 arc-90 23.88,10.56 23.74,10.56 arc90 23.48,10.31 U$14.GATEP
  Top 0.3: v31.35,3.29 32.4,3.29 U$25.A
  Top 0.305: U$14.IN 24.13,11.77 | 24.13,12.05 24.16,12.05
  Top 0.406: 24.13,11.76 24.13,11.77 24.13,12.05 | U$25.A 32.56,3.42
  Top 0.45: 24.14,11.33 U$14.IN 24.14,12.14 24.14,12.15 R17.2 26.74,11.97
  Top 0.813: U$17.1 U$17.2 28.29,10.99 arc90 27.38,11.9 26.98,11.9 R17.2
  Bottom 0.305: v31.35,3.29 arc90 31.08,3.56 29.97,3.56 arc-90 28.29,5.24 U$17.1
5V0_MC_RPI  (via drill 0.45, 0.5)  (1 unrouted)
  Top 0.25: U$14.OUT 22.84,10.13 arc90 22.28,10.68 20.61,10.68
  Top 0.305: U$14.OUT 22.84,9.09 | 22.84,8.9 22.84,8.2 22.82,8.18 22.82,8.07 v22.84,8.05 | v33.9,2.3 33.9,2.15 34.8,3.05 34.92,3.05 U$24.A
  Top 0.45: 20.61,10.68 19.86,11.42
  Top 0.5: v19.91,12.47 19.86,12.42 19.86,11.42 | 20.34,11.1 20.34,11.13 20.16,11.13 C10.2 20.07,13.93 U$13.D1$1 20.64,13.63 v19.91,13.63 19.89,13.62 19.89,12.91 | 20.5,13.6 20.5,11.51
  Top 0.55: U$13.D1$1 U$13.D1$2 | 20.75,13.59 22,13.59
  Bottom 0.305: v33.9,2.3 24.11,2.3 arc-90 22.84,3.57 v22.84,8.05
  Bottom 1: RPI.1 5.96,47.08 arc90 2.96,44.08 2.96,20.01 arc90 6.06,16.91 17.21,16.91 arc-90 19.91,14.21 v19.91,13.63 v19.91,12.47
  pour Top (no thermals): 19.35,11.15 19.35,14.65 arc-90 19.85,15.15 21.95,15.15 arc-90 22.45,14.65 22.45,13.07 arc-90 22.23,12.85 21.12,12.85 arc90 20.8,12.53 20.8,11.15
7V0  (1 unrouted)
  Top 0.25: U$12.IN 17.68,10.98 arc-90 17.42,10.73 17.28,10.73 arc90 17.02,10.48 U$12.GATEP 16.93,9.31 16.93,8.87 arc-45 16.75,8.43 16.6,8.29 arc45 16.43,7.86 16.43,6.87 R27.2
  Top 0.813: R27.2 17,6.29 17,5.9 arc90 17.82,5.08 27.51,5.08 arc90 29.56,7.13 29.56,7.81
  Bottom 0.813: U$17.3 U$17.5
7V0_MAG  (via drill 0.5)
  Top 0.25: U$12.OUT 16.38,10.42 arc90 16.07,10.72 13.81,10.72 13.81,10.91
  Top 0.45: 13.95,10.77 13.81,10.91 13.36,11.36
  Top 0.55: U$9.D1$2 U$9.D1$1 | 15.77,14.24 14.49,14.24 | 15.77,13.49 14.49,13.49 13.54,13.49
  Top 0.6: U$9.D1$1 13.88,13.96 13.47,13.54 v13.47,12.74
  Top 0.61: U$9.D1$1 14.49,13.49 | 13.54,13.49 13.54,11.48 13.65,11.36 | 13.65,11.36 13.78,11.36 C8.2 | 13.65,11.36 13.36,11.36
  Bottom 0.6: MAG_PWR.3 62.65,51.04 arc-90 65.24,48.45 65.24,3.68 arc-90 62.72,1.16 16.76,1.16 arc-90 13.48,4.44 13.48,11.43 13.47,11.44 v13.47,12.74 v13.47,13.94
  pour Top (no thermals): 12.9,11.65 12.9,14.65 arc-90 13.4,15.15 15.55,15.15 arc-90 16,14.7 16,13.17 arc-90 15.73,12.9 14.67,12.9 arc90 14.35,12.58 14.35,11.65
CS_ADC  (via drill 0.45, 0.5)
  Top 0.305: v44.22,25.57 44.2,25.59 arc45 43.75,25.77 43.23,25.77 | 43.23,25.77 43.23,25.68 | v27.32,27.66 27.32,25.44 27.23,25.22 R8.2 | U$4.11 43.23,25.77 | v21.68,27.68 18.47,27.68 arc-90 17.61,28.53 17.61,36.18 arc-90 18.27,36.84 19.2,36.84 U2.10
  Bottom 0.305: v44.22,25.57 43.4,26.39 31.99,26.39 arc-23 30.54,26.68 28.54,27.51 arc23 27.77,27.66 v27.32,27.66 21.7,27.66 v21.68,27.68
GND  (via drill 0.35, 0.45)  (1 unrouted)
  Top 0.127: v17.58,8.07 17.58,8.1 17.86,8.1
  Top 0.2: 50.38,38.63 49.65,39.36 | v44.46,37.6 v44.47,37.6 R56.1 | J1.4 J1.6 J1.8
  Top 0.25: 17.86,8.1 17.65,8.1 | v17.58,8.07 17.76,8.07 17.76,8.55
  Top 0.3: 55.35,47.05 C9.1 55.47,47.05 54.97,47.19 | 54.36,48.51 13.2
  Top 0.305: 27.63,39.88 U$19.GND_FORCE U$19.GND_SENSE | R21.1 29.48,39.88 27.63,39.88 | 40.41,43.33 arc-45 39.79,41.81 39.22,41.24 arc45 38.44,39.36 38.44,37.56 U$4.29 | 17.62,8.07 17.65,8.1 | 27.03,39.23 27.03,39.88 | 27.63,39.23 27.63,39.88 | U$3.GND 52.08,18.15 | 52.08,18.15 52.08,19.45 52.3,19.45 | 52.3,19.45 R7.2 52.6,19.45 52.6,18.26 | v52.15,18.15 52.08,18.15 | 52.3,19.45 52.3,18.26
  Top 0.4: C10.1 20.42,9.65 22.08,9.65 22.08,9.52 U$14.ON | U$14.GND 24.71,9.41 v25.8,10.5
  Top 0.406: U1.8 50.45,38.55 arc90 50.38,38.63 | C13.2 25.67,36.32 25.67,37.62 | U$11.GND 51.02,48.84 | 54.97,47.19 54.36,48.51
  Top 0.45: U$4.6 39.24,27.31 38.45,28.1 U$4.29 38.45,33.27 38.21,33.03 | 38.21,36.11 38.31,36.2 | U$12.GND 17.68,8.01 17.62,8.07
  Top 0.6: C2.2 43.2,21.03 v43.27,21.1 | C1.2 39.78,21.1 v38.48,21.1 | R31.2 48.83,20.23 48.83,21.45
  Top 0.8: C1.2 C2.2
  Bottom 0.6: v43.27,21.1 43.3,21.1 | v38.48,21.1 38.5,21.1
  other vias: 18.93,28.88 12.35,29.22 34,93 39,93 44,93 49,93 54,93 51.5,90.5 56.5,90.5 59,93 61.5,90.5 64,88 66.5,85.5 56.5,85.5 29,93 19,93 16.5,90.5 14,93 14,88 11.5,90.5 9,93 4,93 1.5,90.5 11.5,85.5 9,88 9,83 14,83 11.5,80.5 4,83 9,78 14,78 16.5,80.5 16.5,75.5 11.5,75.5 6.5,75.5 6.5,70.5 4,68 11.5,70.5 14,73 14,68 4,63 6.5,60.5 14,63 16.5,65.5 16.5,70.5 19,73 19,78 21.5,75.5 21.5,70.5 19,68 21.5,65.5 24,68 26.5,70.5 26.5,75.5 31.5,75.5 29,78 34,78 39,78 36.5,75.5 41.5,75.5 39,73 34,73 31.5,70.5 29,68 34,68 36.5,70.5 41.5,70.5 39,68 41.5,65.5 36.5,65.5 31.5,65.5 26.5,65.5 24,63 29,63 34,63 39,63 36.5,60.5 39,58 31.5,60.5 34,58 26.5,60.5 29,58 21.5,60.5 19,63 16.5,60.5 19,58 24,58 11.5,60.5 14,58 9,58 4,58 6.5,55.5 11.5,55.5 24,48 21.5,50.5 26.5,50.5 16.5,50.5 27,44.2 31.5,40.5 46.5,75.5 49,78 46.5,80.5 51.5,75.5 54,73 51.5,70.5 49,73 46.5,70.5 49,68 46.5,65.5 54,68 51.5,65.5 51.5,60.5 9,43 1.5,85.5 1.5,80.5 1.5,75.5 1.5,70.5 1.5,65.5 1.5,60.5 1.5,55.5 1.5,50.5 1.5,45.5 1.5,40.5 1.5,35.5 4,48 1.5,30.5 1.5,25.5 1.5,20.5 1.5,15.5 1.5,10.5 4,8 6.5,10.5 9,13 11.5,10.5 11.5,15.5 1.5,5.5 4,3 6.5,5.5 9,18.3 66.5,1.75 6.5,1.75 1.5,1.75 60.9,9.2 38.65,27.8 42.3,36 30.9,6.3 20.9,6.8 11.5,20.8 4.5,28 4.5,23 4.5,33 4.5,43 9,38 9,48 61.5,75.5 21.93,25.43 12.4,25.12 16.3,46.8 16.3,40.5 20.83,28.88 17.6,41.9 33.88,24.68 31.73,27.48 19.98,24.33 25.8,6.9 10.95,45.6 43.15,29.8 37.45,29.8 27.1,36.3 25.9,37.6 30.9,4.8 27.6,41.9 23.4,45.3 25.7,45.3 17.5,45.5 66.8,6.95 49.6,37.65 49.6,36.75 47.92,21.45 50.6,11.2 50.45,10.3 58,25.55 58,24.55 57.65,20.75 46.55,15.3 11.6,28.57 37.93,18.63 56.8,34.3 56,38.7 59,36.55 30.5,12.15 31,10.85 37.73,15.23 26,16.45 51.2,49.65 55.45,45.85 54.5,44.9 56.4,15.75 57.85,16.2 57.85,7.8 57.85,6.3 54.6,3.1 56.45,3.1 54,63 44,63 16.5,85.5 19,83 21.5,85.5 19,88 24,88 21.5,90.5 29,88 26.5,85.5 24,83 21.5,80.5 24,78 29,83 26.5,80.5 31.5,80.5 31.5,85.5 34,83 36.5,80.5 39,83 41.5,80.5 44,83 44,78 44,73 44,68 51.5,80.5 54,78 49,83 59,83 64,73 64,68 64,63 64,58 61.5,55.5 64,53 64,48 58.85,45 19,3 21.75,3 27.7,3.45 25.2,3.45 18.08,25.38 38.68,39.68 43.68,48.73 34.45,40.3 31.5,50.5 36.5,50.5 41.5,50.5 24.6,40.65 41.3,28.45 50.6,33.9 58.4,41.35 60.95,34.9 59.7,38.7 61.75,31.85 53.75,29.9 61.9,18.35 18.9,21.85 21.8,21.85 24,93 54.45,34.95 58.6,29.15 63.85,14.6 63.65,3.65 56.1,36.55 61.25,42 31.9,11.85
  pour Top (no thermals): -3.57,2.53 -3.57,95.52 -0.6,98.49 54.78,98.49 70.39,82.88 70.39,0.83 66.43,-3.13 2.09,-3.13
  pour Bottom (no thermals): -2.1,2.16 -2.1,94.28 0.73,97.11 56.56,97.11 69.8,83.87 69.8,0.99 66.39,-2.42 2.48,-2.42
INDI
  Top 0.305: 36.04,38.18 arc90 34.96,39.26 32.85,39.26 arc-90 U$18.A | U$4.32 36.04,38.18 | 36.04,38.18
INT<<MAG
  Top 0.305: U$4.9 41.63,25.33 arc45 41.99,24.46 42.13,24.32 arc45 43.84,23.61 48.56,23.61 arc45 50.09,24.24 52.26,26.41 arc-45 52.96,26.7 58.75,26.7 arc-90 59.75,25.7 59.75,24.68 arc45 60.23,23.52 COM_MAG.2
INT<<MAIN  (via drill 0.45)
  Top 0.305: v40.84,24.32 arc45 v40.84,24.32 | U$4.8 v40.84,24.32 | U$17.6 30.83,9.56 29.75,10.64 arc-45 29.31,11.7 29.31,13.53 R22.2 29.83,14.05
  Top 0.508: v30.85,14.05 29.83,14.05
  Bottom 0.305: v40.84,24.32 arc45 38.93,25.11 36.44,25.11 arc45 35.23,24.61 arc45 34.78,23.52 34.78,22.04 arc-90 34.2,21.45 28.43,21.45 arc90 27.2,20.21 27.2,16.85 arc90 29.05,15 29.07,15 arc-45 30.49,14.41 v30.85,14.05
INT<<RPI  (via drill 0.4)
  Top 0.305: U$4.10 | v43.24,24.67 42.95,24.67 arc-45 42.68,24.78 arc-45 42.44,25.35 U$4.10 | v18.24,20.7 17.72,21.22 arc45 15.4,22.18 13.86,22.18 arc-90 9.35,26.68 9.35,31.44 arc-45 10.12,33.3 10.54,33.73 arc45 11.34,35.65 11.34,42.68 arc90 9.57,44.45 6.79,44.45 RPI.2
  Bottom 0.305: v43.24,24.67 43.24,24.73 43.02,24.95 arc45 41.06,25.76 24.44,25.76 arc90 23.17,24.49 23.17,21.97 arc-90 21.9,20.7 v18.24,20.7
INT>>MAIN  (via drill 0.45)
  Top 0.305: v37.64,24.26 37.62,24.26 37.62,25.99 37.64,26.01 U$4.4
  Bottom 0.305: v37.64,24.26 37.64,23.02 arc-45 37.53,22.75 37.46,22.68 arc45 37.34,22.38 37.34,20.06 arc-90 36.26,18.97 33.28,18.97 arc90 32.3,17.99 32.3,17.29 arc45 33.17,15.18 36.63,11.71 arc-45 37.18,10.4 U$17.16
MC_SPI_CLK
  Top 0.305: U$4.37 30.31,33.41 R5.1 29.65,34.18 28.45,34.18 arc45 27.56,33.81 27.66,33.91 arc-45 26.43,33.41 U$1.C 23.01,33.41 arc-45 22.34,33.68 arc-45 21.97,34.59 21.97,36.95 arc45 20.6,40.24 arc45 19.91,40.53 19.82,40.62 U2.13
MC_SPI_MISO
  Top 0.305: U$1.DQ1 16.04,24.52 arc90 17.04,25.52 17.04,38.02 arc-90 18.37,39.35 U2.12 19.68,39.35 19.68,39.35 arc-45 20.51,39.01 arc-45 21.36,36.95 21.36,34.34 arc45 21.83,33.2 21.99,33.04 arc45 22.62,32.78 28,32.78 arc-45 29.18,32.29 29.74,31.73 R3.1 30.21,31.73 32.16,29.78 arc45 33.05,29.41 33.49,29.41 U$4.42
MC_SPI_MOSI
  Top 0.2: U$4.43 33.4,28.51 33.34,28.51
  Top 0.305: 33.34,28.51 28.9,28.51 arc-45 27.36,29.15 27.2,29.31 R4.1 26.95,29.31 25.83,30.43 arc-45 25.56,31.08 25.56,31.43 arc45 25.39,31.84 arc45 24.68,32.13 U$1.DQ0 22.78,32.13 arc-45 21.41,32.71 arc-45 20.75,34.29 20.75,36.88 arc45 20.38,37.77 arc45 19.64,38.08 19.63,38.09 U2.11
MCLR_MAG  (via drill 0.45)
  Top 0.305: v59.15,20.95 59.15,19.7 Q7.3
  Bottom 0.305: U$22.19 37.6,90.06 arc-45 39.02,90.65 47.65,90.65 arc-45 49.07,90.06 58.12,81.02 arc-45 59.98,76.51 59.98,71.73 arc45 60.57,70.31 PANEL.5 62.25,68.63 arc-45 62.9,67.05 62.9,59.51 arc-45 62.3,58.05 60.48,56.23 arc45 59.7,54.34 59.7,46.19 arc45 60.4,44.5 62.27,42.63 arc-45 62.85,41.22 62.85,35.63 arc-45 62.41,34.56 60.16,32.31 arc45 59.65,31.07 59.65,21.95 arc-45 59.29,21.09 v59.15,20.95
MCLR_MC  (via drill 0.45)
  Top 0.305: v46.89,32.58 46.89,32.61 46.88,32.6 U$4.18 44.29,32.6 44.28,32.61 arc-90 43.47,33.42 43.47,35.74 arc-90 44.21,36.48 46.55,36.48 arc45 47.19,36.75 47.85,37.41 R1.1
  Top 0.4: v49.65,13.65 49.65,15.15 Q8.3
  Bottom 0.305: U$17.19 39.71,6.78 arc90 40.8,5.68 46.5,5.68 arc90 49.35,8.53 49.35,12.94 arc-45 v49.64,13.64 v49.65,13.65 50.18,14.18 arc45 50.47,14.88 50.47,30.44 arc45 50.18,31.14 49.26,32.06 arc45 47.98,32.59 v46.9,32.59 v46.89,32.58 46.91,32.6 46.72,32.6 46.73,32.59 9.12,32.59 arc65 7.2,31.36 6.7,30.28 PROGRAM.1
N$1
  Top 0.4: U$8.ON 42.97,18.04 R10.1 42.97,16.67 arc90 43.54,16.1 U3.2
N$2
  Top 0.3: R23.1 47.99,1.8 47.46,1.8
  Top 0.305: U$21.A 47.45,1.8 47.46,1.8
N$3
  Top 0.3: Y1.2 35.94,43.99 35.94,48.1 C3.1
  Top 0.305: Y1.2 37.27,42.66 arc-45 37.64,41.76 U$4.30
N$4
  Top 0.305: U$23.C 42.53,1.61 R24.2
N$5
  Top 0.3: C4.1 31.25,43.98 Y1.1
  Top 0.305: U$4.31 36.85,38.57 arc45 36.27,39.98 32.65,43.6 arc45 31.94,43.89 Y1.1
N$6
  Top 0.305: R25.2 35.29,1.61 U$24.C
N$7
  Top 0.305: U$25.C 32.25,1.61 R26.2
N$8  (via drill 0.45)
  Top 0.305: U$1.S# 16.23,25.79 v16.25,25.8 | v28.11,26.67 28.13,26.68 arc-90 29.56,25.25 29.56,25.06 R2.1 29.68,24.71 29.98,24.38 arc-45 31.48,23.76 31.9,23.34 arc45 33.74,22.58 37.2,22.58 arc90 38.44,23.82 38.44,26.06 U$4.5
  Bottom 0.305: v28.11,26.67 19.93,26.67 arc22 16.86,26.06 v16.26,25.81 arc45 v16.25,25.8
N$9
  Top 0.254: R26.1 29.66,1.22
  Top 0.305: R25.1 37.57,1.29 arc-45 36.26,0.75 31.44,0.75 arc-45 29.88,1.39 R26.1 29.59,1.25 13.58,1.25 arc-45 12.04,1.89 IND.1 | R24.1 40.51,1.3 40.63,1.18 arc45 41.58,0.79 44.59,0.79 U$21.C
  Top 0.813: R24.1 R25.1
N$10
  pour Top (no thermals): 53.96,10.4 54.52,10.4 arc-90 55.15,9.77 55.15,6.27 arc-90 54.83,5.95 54.27,5.95 arc-90 53.95,6.27 53.95,7.68 arc90 53.63,8 52.87,8 arc90 52.55,7.68 52.55,6.27 arc-90 52.23,5.95 51.52,5.95 arc-90 51.25,6.22 51.25,7.76 arc-45 51.39,8.09 53.51,10.21 arc-45
N$11
  Top 0.25: U$3.SENSE 52.73,12.64 U$2.D2$1
  pour Top (no thermals): 48.95,8.95 48.95,7.4 51,7.4 51,7.79 arc-45 51.22,8.32 53.41,10.51 arc45 53.55,10.84 53.55,12.88 arc90 53.33,13.1 51.82,13.1 arc90 51.5,12.78 51.5,10.48 arc-45 51.19,9.74 50.67,9.22 arc-45 50.02,8.95
N$12
  Top 0.25: U$2.G1 55.77,9.87 arc90 54.88,10.75 54.48,10.75 arc-90 53.86,11.38 53.86,12.93 arc45 53.72,13.26 53.62,13.36 arc-45 53.49,13.67 53.49,14.14 U$3.GATE
  Top 0.305: U$2.G1 55.77,5.99 arc-90 55.4,5.62 53.23,5.62 | U$2.G2 53.23,5.62 | 53.23,5.62 53.23,5.58 52.55,4.9 Q5.2
N$13
  Top 0.305: Q6.2 58.49,1.87 57.71,1.09 arc-45 57.26,0.9 54.59,0.9 arc-45 54.14,1.09 53.5,1.73 Q5.3
  Top 0.406: R28.2 50.59,1.89 53.36,1.89 53.4,1.93 Q5.3
N$14
  Top 0.5: U$9.S1 15.77,18.3 arc90 16.6,17.46 18.07,17.46 arc90 18.36,17.75 18.36,19.16 U$9.S2
  pour Top (no thermals): 15.7,20.1 15.95,20.1 arc-90 16.2,19.85 16.2,18.9 16.2,18.35 arc90 16.45,18.1 17.1,18.1 17.65,18.1 arc90 17.9,18.35 17.9,18.7 17.9,19.85 arc-90 18.15,20.1 18.2,20.1 18.45,20.1 arc-90 18.7,19.85 18.7,19.3 18.7,17.73 arc-90 18.07,17.1 17.7,17.1 16.04,17.1 arc-90 15.4,17.73 15.4,18.7 15.4,19.85 arc-90 15.65,20.1
N$15
  Top 0.305: R21.2 29.99,37.68
  Top 0.61: U$18.C 29.99,37.68
N$16
  Top 0.305: 17.04,11.82 U$12.SENSE
  Top 0.45: U$9.D2$1 17.04,11.82
  Top 0.5: R27.1 18.55,6.64 18.75,6.44 arc-45 18.62,6.76 | 18.33,13.4 18.3,13.43 U$9.D2$2
  Top 0.55: U$9.D2$1 U$9.D2$2 | 18.62,6.76 18.62,12.7 arc45 18.33,13.4
  pour Top (no thermals): 18.7,13.25 18.7,14.65 arc90 18.2,15.15 16.95,15.15 arc90 16.7,14.9 16.7,13.25 arc90 16.95,13 18.45,13 arc90
N$17
  Top 0.254: U$9.G1 14.49,16.35 arc90 15.2,15.65 15.83,15.65 arc-90 16.38,15.1 16.38,11.81
  Top 0.305: 16.38,11.81 U$12.GATE
  Top 0.5: U$9.G1 14.49,19.91 arc-90 15.15,20.56 16.34,20.56 arc-90 17.04,19.86 U$9.G2
N$18
  Top 0.406: R29.2 56.83,9.16 arc45 56.64,8.71 56.64,5.99 arc45 56.83,5.54 57.54,4.82 Q6.3
N$19
  Top 0.305: U$7.S2 43.01,6.45 | 45.55,6.5 U$7.S1
  Top 0.5: U$7.S2 43.01,8.46 45.34,8.46 | 45.55,8.46 U$7.S1
  pour Top (no thermals): 43.6,7.98 43.6,6.27 arc-90 43.28,5.95 42.92,5.95 arc-90 42.6,6.27 42.6,9.52 arc-90 43.23,10.15 44.37,10.15 arc-45 44.82,9.96 45.96,8.82 arc-45 46.15,8.37 46.15,6.42 arc-90 45.83,6.1 45.32,6.1 arc-90 45,6.42 45,7.83 arc90 44.68,8.15 43.77,8.15 arc90
N$20
  Top 0.25: U$8.SENSE 39.38,13.26 R9.1
  Top 0.305: U$7.D2$1 U$7.D2$2
  Top 0.4: R9.1 39.9,12.96 43.01,12.96 U$7.D2$2 43.01,12.6
  pour Top (no thermals): 38.95,13.65 44.16,13.65 arc-90 44.8,13.02 44.8,11.47 arc-90 44.48,11.15 42.86,11.15 arc-45 42.41,11.34 41.49,12.26 arc45 41.04,12.45 38.95,12.45
N$21
  Top 0.305: Q8.2 47.84,14.2 arc90 48.26,14.62 48.26,15.38 arc-90 48.78,15.9 49.18,15.9 arc90 49.65,16.37 49.65,17.7 R31.1
  Top 0.406: U3.1 Q8.2
  Top 1.016: R30.2 R31.1
N$22  (via drill 0.45)
  Top 0.25: U$8.GATE 40.03,14.72 arc90 40.35,14.4 41.2,14.4 v41.2,14.35
  Top 0.305: U$7.G1 arc45 46.81,7.56 | 44.27,7.53 U$7.G2 44.27,5.96 arc90 44.59,5.64 46.5,5.64 arc90 46.81,5.96 U$7.G1 | Q1.2 34.83,17.55 arc90 35.33,17.05 v35.8,17.05 | U$7.G1 46.81,8.35 arc45 46.54,9.01 45.29,10.26 arc45 44.35,10.65 42.21,10.65 arc-45 41.76,10.84 v41.2,11.4
  Bottom 0.305: v35.8,17.05 35.9,16.95 arc45 36.87,16.55 40.15,16.55 arc-90 41.2,15.5 v41.2,14.35 v41.2,11.4
N$23
  Top 0.254: U$3.ON 54.02,17.13 54.33,17.43 54.33,19.32 R7.1
  Top 0.305: R7.1 53.74,19.9 53.74,20.34 arc90 53.32,20.76 53.22,20.76 arc-90 52.8,21.18 52.8,22.83 arc-90 53.22,23.25 53.89,23.25 U4.2
N$24
  Top 0.305: R55.2 34.09,13.25 Q2.2
  Top 0.406: R55.2 36.02,13.25 35.78,13.49 Q1.3
  pour Top (no thermals): 33.9,12.65 33.9,14.45 arc-45 34.09,14.9 34.6,15.41 arc-45 35.05,15.6 36.02,15.6 36.02,15.12 arc90 36.78,14.35 37.43,14.35 arc-90 37.75,14.03 37.75,12.65
N$25
  Top 0.254: U4.1 54.8,21.45 arc-90 55.25,21 55.25,19.27 arc90 55.67,18.85 56.1,18.85 Q7.2
  Top 0.305: U4.1 53.64,21.45 53.59,21.5 53.59,21.9 arc-90 54.09,22.4 56.25,22.4 R32.1
  Top 0.813: R33.2 56.25,25.25 R32.1
N$26
  Top 0.4: Q2.3 33.14,18.51 33.05,18.6 32.79,18.6 R12.2
N$28
  pour Top (no thermals): 41,47.25 41.43,47.25 arc-90 41.75,46.93 41.75,46.5 41.75,46.42 arc-90 41.43,46.1 41.15,46.1 39.12,46.1 arc-90 38.8,46.42 38.8,48.3 38.8,49.48 arc-90 39.12,49.8 40.8,49.8 41.43,49.8 arc-90 41.75,49.48 41.75,49.15 41.75,48.97 arc-90 41.43,48.65 41.4,48.65 40.02,48.65 arc90 39.7,48.33 39.7,47.6 39.7,47.57 arc90 40.02,47.25
N$29
  Top 0.2: U$10.D1$1 U$10.D1$2
  Top 0.254: U$11.SENSE 47.88,48.19 arc90 47.26,47.57 47.26,46.99 arc-90 46.94,46.67 U$10.D1$2
  pour Top (no thermals): 43.2,42.65 43.2,46.56 arc-90 43.84,47.2 45.6,47.2 46.73,47.2 arc-90 47.05,46.88 47.05,46.75 47.05,45.22 arc-90 46.73,44.9 46.6,44.9 45.25,44.9 arc90 44.75,44.4 44.75,43.7 44.75,41.9 43.2,41.9
N$30  (via drill 0.35, 0.45)
  Top 0.25: U$11.GATE 49.33,47.53 arc-90 49.65,47.22 49.65,45.75 49.7,45.75 v49.7,45.8
  Top 0.305: 40.34,47.95 U$10.G2 40.27,47.95 | v49.7,45.8 50.37,45.8 arc-90 50.84,45.33 50.84,44.52 Q3.2
  Top 0.4: 41.22,47.95 U$10.G2 | 41.3,45.41 U$10.G1
  Top 0.45: U$10.G1 42.38,45.41 arc90 v42.4,45.42 42.4,47.3 arc90 41.75,47.95 U$10.G2
  Bottom 0.305: v49.7,45.8 49.67,45.77 arc-45 48.77,45.4 42.43,45.4 v42.4,45.42
N$33
  Top 0.3: Q3.3 50.7,41.87 arc-90 49.75,42.82 49.75,43.47 arc90 49.12,44.1 48.75,44.1 48.37,44.48 R15.2
  Top 0.305: Q3.3 51.84,41.57 52.02,41.38 arc45 53.06,40.96 55.69,40.96 arc45 56.3,41.21 56.66,41.57 Q4.2
  Top 0.406: R15.2 48.43,44.57
N$34
  Top 0.25: R16.2 57.28,46.45 57.28,45.51 arc-90 56.65,44.87 55.81,44.87 55.71,44.77 Q4.3
N$36
  Top 0.5: U$13.S1 22.2,18.05 arc90 22.63,17.62 24.13,17.62 arc90 24.77,18.25 24.77,19.14
  Top 0.508: U$13.S1 22.16,19.14 | 24.77,19.14 U$13.S2
  pour Top (no thermals): 22.85,18.1 24.05,18.1 arc90 24.3,18.35 24.3,19.85 arc-90 24.55,20.1 24.95,20.1 arc-90 25.2,19.85 25.2,17.73 arc-90 24.57,17.1 22.43,17.1 arc-90 21.8,17.73 21.8,19.85 arc-90 22.05,20.1 22.35,20.1 arc-90 22.6,19.85 22.6,18.35 arc90
N$37
  Top 0.305: U$13.D2$1 23.48,13.9 U$14.SENSE
  Top 0.406: 23.52,13.98 23.48,13.94 | U$13.D2$2 24.83,14.02
  Top 0.45: U$13.D2$1 23.52,13.98
  Top 0.5: 24.73,13.96 U$13.D2$2
  Top 0.55: U$13.D2$2 U$13.D2$1
  Top 0.6: R17.1 26.79,13.86 24.73,13.96
  pour Top (no thermals): 27.6,13.1 27.6,15.08 arc90 27.28,15.4 23.52,15.4 arc90 23.2,15.08 23.2,13.4 arc90 23.5,13.1
N$38
  Top 0.254: U$13.G1 20.93,16.39 arc90 21.56,15.75 22.2,15.75 arc-90 22.84,15.12 22.84,11.77
  Top 0.305: 22.84,11.77 U$14.GATE 22.84,11.77 | 20.93,19.73 U$13.G1
  Top 0.5: U$13.G2 23.46,20.09 arc90 22.83,20.73 21.56,20.73 arc90 20.93,20.09 U$13.G1
OUT0_ADC  (via drill 0.5)
  Top 0.6: U2.1 13.88,44.44 13.7,44.61 v13.7,45.74
  Bottom 0.5: v13.7,45.74 13.7,47.66 arc90 11.7,49.66 5.87,49.66 arc-90 2.66,52.87 2.66,83.73 arc-45 3.72,86.29 U$26.1
  Bottom 0.6: v13.7,45.74 13.7,45.69
PGC_MAG
  Bottom 0.305: U$22.13 39.24,87.89 arc-45 40.66,88.48 46.74,88.48 arc-45 48.16,87.89 56.41,79.64 arc-45 58.03,75.73 58.03,63.02 arc45 58.7,61.4 60.24,59.86 arc45 PANEL.1
PGC_MC  (via drill 0.45)
  Top 0.305: v46.88,30.97 v46.87,30.98 45.02,30.98 U$4.16 | U$17.11 arc-45 34.65,7.89 35.02,7 arc67 36.88,5.76 41.46,5.76 arc90 42.09,6.39 42.09,7.26 v41.84,7.51
  Bottom 0.305: 13.79,30.97 v46.88,30.97 47.24,30.97 arc-45 48.35,30.51 48.72,30.14 arc-45 49.01,29.44 49.01,15.92 arc-45 48.72,15.22 47.95,14.45 arc45 47.66,13.74 47.66,9.46 arc-90 45.71,7.51 v41.84,7.51 | 13.79,30.97 | 13.79,30.97 arc90 9.71,26.89 9.71,22.96 arc-90 6.7,19.95 PROGRAM.5
PGD_MAG
  Bottom 0.305: U$22.15 38.67,88.59 arc-45 40.09,89.18 47.08,89.18 arc-45 48.5,88.59 56.95,80.14 arc-45 58.7,75.91 58.7,63.06 arc90 59.8,61.96 PANEL.2
PGD_MC  (via drill 0.45)
  Top 0.305: v47.91,31.77 47.89,31.79 45,31.79 U$4.17 | v41.17,6.59 arc-45 40.54,6.33 37.64,6.33 arc-68 36.14,7.33 36.02,7.62 35.91,7.73 arc45 U$17.13
  Bottom 0.305: v41.17,6.59 45.95,6.59 arc90 48.5,9.14 48.5,13.36 arc-45 48.79,14.06 49.44,14.71 arc45 49.73,15.41 49.73,29.94 arc45 49.44,30.64 48.59,31.49 arc45 v47.91,31.77 13.22,31.77 arc90 8.96,27.51 8.96,24.73 arc-90 PROGRAM.4
RESET_MAG
  Bottom 0.305: U$17.15 37.18,6.98 arc90 40.01,4.15 55.82,4.15 arc90 59.66,7.99 59.66,17.74 arc-45 60.04,18.66 COM_MAG.1
RESET_MAG_EXT  (via drill 0.45)
  Top 0.305: U$4.35 32.6,35.01 arc-45 31.9,35.3 v31.76,35.44
  Top 0.508: R33.1 54.35,25.15 v52.81,25.15
  Bottom 0.305: v52.81,25.15 51.5,26.46 arc-45 51.21,27.16 51.21,30.99 arc45 50.92,31.69 48.06,34.55 arc45 46.99,34.99 32.62,34.99 arc-45 31.92,35.28 v31.76,35.44
RESET_MC_EL  (via drill 0.45)
  Top 0.6: v45.38,19.93 46.73,19.93 R30.1
  Bottom 0.305: v45.38,19.93 45.35,19.95 43.02,17.62 arc-45 42,17.2 37.71,17.2 arc-45 36.84,17.56 36.52,17.88 arc45 36.11,18.05 35.59,18.05 arc90 34.75,17.21 34.75,15.4 arc45 35.31,14.04 37.96,11.39 arc-45 38.45,10.2 U$17.18
RESET_MC_GNSS  (via drill 0.45)
  Top 0.254: 51.2,46.88 U$11.ON 53.24,46.88 13.1
  Top 0.4: U$4.24 42.44,38.6 arc-45 42.59,38.96 v42.66,39.03
  Top 0.406: 53.48,46.95 13.1
  Top 0.61: v53.48,45.82 53.48,46.95
  Bottom 0.305: v42.66,39.03 arc-90 42.66,39.1 43.07,39.51 arc-45 44.59,40.14 48.84,40.14 arc45 50.8,40.95 52.88,43.03 arc45 53.38,44.23 53.38,45.72 v53.48,45.82
RPI_EPS_IO_1
  Top 0.305: U$22.1 59.37,87.1 arc-45 60.79,86.51 65.2,82.1 arc-45 66.3,79.45 66.3,11.05 arc-45 65.06,8.06 64.69,7.69 arc-23 63.12,6.64 61.74,6.07 arc45 U$20.1
RPI_EPS_IO_2
  Top 0.305: U$20.2 61.53,3.53 65.76,7.76 arc45 67,10.75 67,79.75 arc45 65.83,82.57 61.33,87.07 arc45 59.33,87.9 49.63,87.9 arc-45 48.73,88.27 48.67,88.33 arc45 47.77,88.7 46.43,88.7 arc45 45.53,88.33 45.15,87.95 arc45 U$22.3
RX_GNSS  (via drill 0.45)
  Top 0.2: J1.3 42.61,59.6 arc45 42.25,59.45 v42,59.2
  Top 0.305: U$4.44 34.56,27.82 arc45 35.01,28.01 35.42,28.42 arc45 35.61,28.87 35.61,34.43 arc45 35.05,35.78 v35.01,35.82
  Bottom 0.305: v35.01,35.82 35.01,36.07 35.51,36.57 arc-45 36.35,36.92 37.18,36.92 arc45 38.27,37.38 41.92,41.02 arc-45 43.44,41.65 48.33,41.65 arc45 49.73,42.23 51.23,43.73 arc45 51.6,44.63 51.6,45.59 arc-45 52.42,47.57 55.34,50.49 arc45 55.6,51.11 55.6,56.61 arc90 53.39,58.82 42.76,58.82 arc-45 42.06,59.11 42,59.17 v42,59.2
RX_MC_TX_MAG
  Top 0.127: R20.1 47.62,26.95 47.1,26.95
  Top 0.305: 44.99,29.41 U$4.14 46.47,29.42 arc-90 47.1,28.79 47.1,26.95 | R20.1 47.95,27.35 61.11,27.35 COM_MAG.4
RX_MC_TX_MAIN  (via drill 0.45)
  Top 0.305: v36.8,23.42 36.8,25.97 36.85,26.02 U$4.3
  Top 0.508: v29.47,17.1 29.47,18.4 29.92,18.4 R18.1
  Bottom 0.305: v36.8,23.42 36.8,23.22 36.79,23.21 arc45 36.5,22.51 36.5,20.84 arc-90 35.47,19.8 30.41,19.8 arc90 29.47,18.86 v29.47,17.1 29.5,17.1 arc-45 30.86,16.54 35.02,12.38 arc-45 35.91,10.24 U$17.14
RX_MC_TX_RPI  (via drill 0.45)
  Top 0.305: U$4.19 47.88,33.41 v47.91,33.4
  Bottom 0.305: 47.89,33.41 v47.91,33.4 8.03,33.4 arc-90 5.22,36.21 5.22,37.13 arc-45 5.81,38.55 6.7,39.44 RPI.4
SELECT  (via drill 0.45)
  Top 0.152: U$4.23 43.23,38.1 43.24,38.1
  Top 0.305: v53.28,38.64 arc45 53.05,38.1 U1.4 | 43.24,38.1 43.98,38.84 arc-45 44.11,38.89 44.11,38.95 v44.12,38.96 44.16,38.92 45.22,38.92 45.71,39.41 R56.2
  Bottom 0.305: v44.12,38.96 44.15,38.99 arc-45 45.04,39.36 49.13,39.36 arc-45 50.03,38.99 arc45 50.87,38.64 v53.28,38.64
TRCLK>>COM  (via drill 0.45)
  Top 0.305: U1.2 54.35,38.85 v54.38,38.85
  Bottom 0.305: v54.38,38.85 54.38,40.95 arc-45 55.26,43.08 57.63,45.45 arc45 58.56,47.69 58.56,59.72 arc45 58.13,60.75 57.95,60.93 arc-45 57.35,62.38 57.35,75.54 arc45 55.9,79.05 49.85,85.1 arc45 48.08,85.83 U$22.2
TRCLK_MC
  Top 0.305: U$4.21 52.44,35.01 arc91 53.7,36.3 U1.3
TRCLK_RPI
  Top 0.305: U1.1 55.01,36.48 arc90 56.01,35.48 59.33,35.48 arc45 60.04,35.77 61,36.73 U$16.1
TRDAT>>COM  (via drill 0.45)
  Top 0.305: U1.6 51.76,38.54 arc45 51.47,39.22 v51.23,39.46
  Bottom 0.305: U$22.4 44.8,85.57 45.24,85.13 arc45 45.86,84.87 47.96,84.87 arc-45 49.73,84.14 55.5,78.37 arc-45 56.69,75.5 56.69,61.51 arc45 57.22,60.23 57.27,60.18 arc-45 57.8,58.9 57.8,47.68 arc-45 57.19,46.2 51.78,40.79 arc45 v51.23,39.46
TRDAT_MC
  Top 0.305: U1.7 51.09,37.28 51.09,36.55 arc-90 50.34,35.8 U$4.22
TRDAT_RPI
  Top 0.305: U1.5 52.41,38.63 arc-90 53.42,39.65 59.88,39.65 arc-45 61.15,39.12 U$16.2
TX_GNSS  (via drill 0.45)
  Top 0.2: v42.01,60.33 42.19,60.15 arc45 42.54,60 J1.5
  Top 0.305: U$4.1 35.25,27.08 arc-45 35.44,27.53 35.82,27.91 arc45 36.21,28.85 v36.21,35.93
  Bottom 0.305: v36.21,35.93 37.34,35.93 arc45 38.35,36.35 42.31,40.31 arc-45 43.73,40.9 48.42,40.9 arc45 50.35,41.7 52.08,43.43 arc45 52.45,44.33 52.45,45.76 arc-45 52.93,46.92 55.82,49.81 arc45 56.25,50.84 56.25,56.71 arc90 53.52,59.44 43.31,59.44 arc-45 42.6,59.73 v42.01,60.33
TX_MC_RX_MAG
  Top 0.305: U$4.15 49.12,30.21 arc-45 49.82,29.92 R19.1 50.47,29 51.28,28.19 arc45 51.73,28 58.81,28 arc45 59.51,28.29 COM_MAG.5
TX_MC_RX_MAIN  (via drill 0.45)
  Top 0.305: v35.68,23.44 arc45 36.05,24.33 U$4.2
  Top 0.508: v28.34,17.1 28.32,17.12 28.32,17.98 R11.1
  Bottom 0.305: v35.68,23.44 35.68,21.54 arc-90 34.8,20.65 29.52,20.65 arc90 28.34,19.46 v28.34,17.1 | v28.34,17.1 | v28.34,17.1 arc90 29.54,15.9 29.92,15.9 arc-43 31,15.45 34.15,12.3 arc-45 34.64,11.11 U$17.12
TX_MC_RX_RPI  (via drill 0.45)
  Top 0.305: U$4.20 46.82,34.2 v46.89,34.21
  Bottom 0.305: v46.89,34.21 8.7,34.21 arc-90 6.7,36.21 RPI.5
VDD_MAG
  Bottom 0.305: U$22.17 38.1,89.29 arc-45 39.52,89.88 47.4,89.88 arc-45 48.82,89.29 57.56,80.55 arc-45 59.33,76.28 59.33,69.84 arc45 59.92,68.42 PANEL.4
VREF_2V5
  Top 0.305: C13.1 24.28,36.37
  Top 0.45: 24.28,36.37 24.28,38.41 arc90 23.45,39.23 U$19.VOUT_SENSE 22.88,39.24 22.88,39.88 U$19.VOUT_FORCE 22.27,39.88 arc-90 21.29,40.87 21.29,42.16 arc90 20.29,43.16 U2.15

### Text on the board
tNames: YOTSUBA_MC_ver.2.4.1 | +X | 5V | MC | 28
bNames: ADC IN | -X | TML:MAG | K. Hirakawa / S. Tanaka / Y. Nakazaki / Y. Tomohiro / Y. Fujita | PWR:MAG | PWR/COM:RPI | TR:RPI | TML:MC | COM:MAG | PS:RPI
tDocu: IN